# EAGLE schematic cpu (EAGLE 9.2.2)

## Sheet 1 of 8
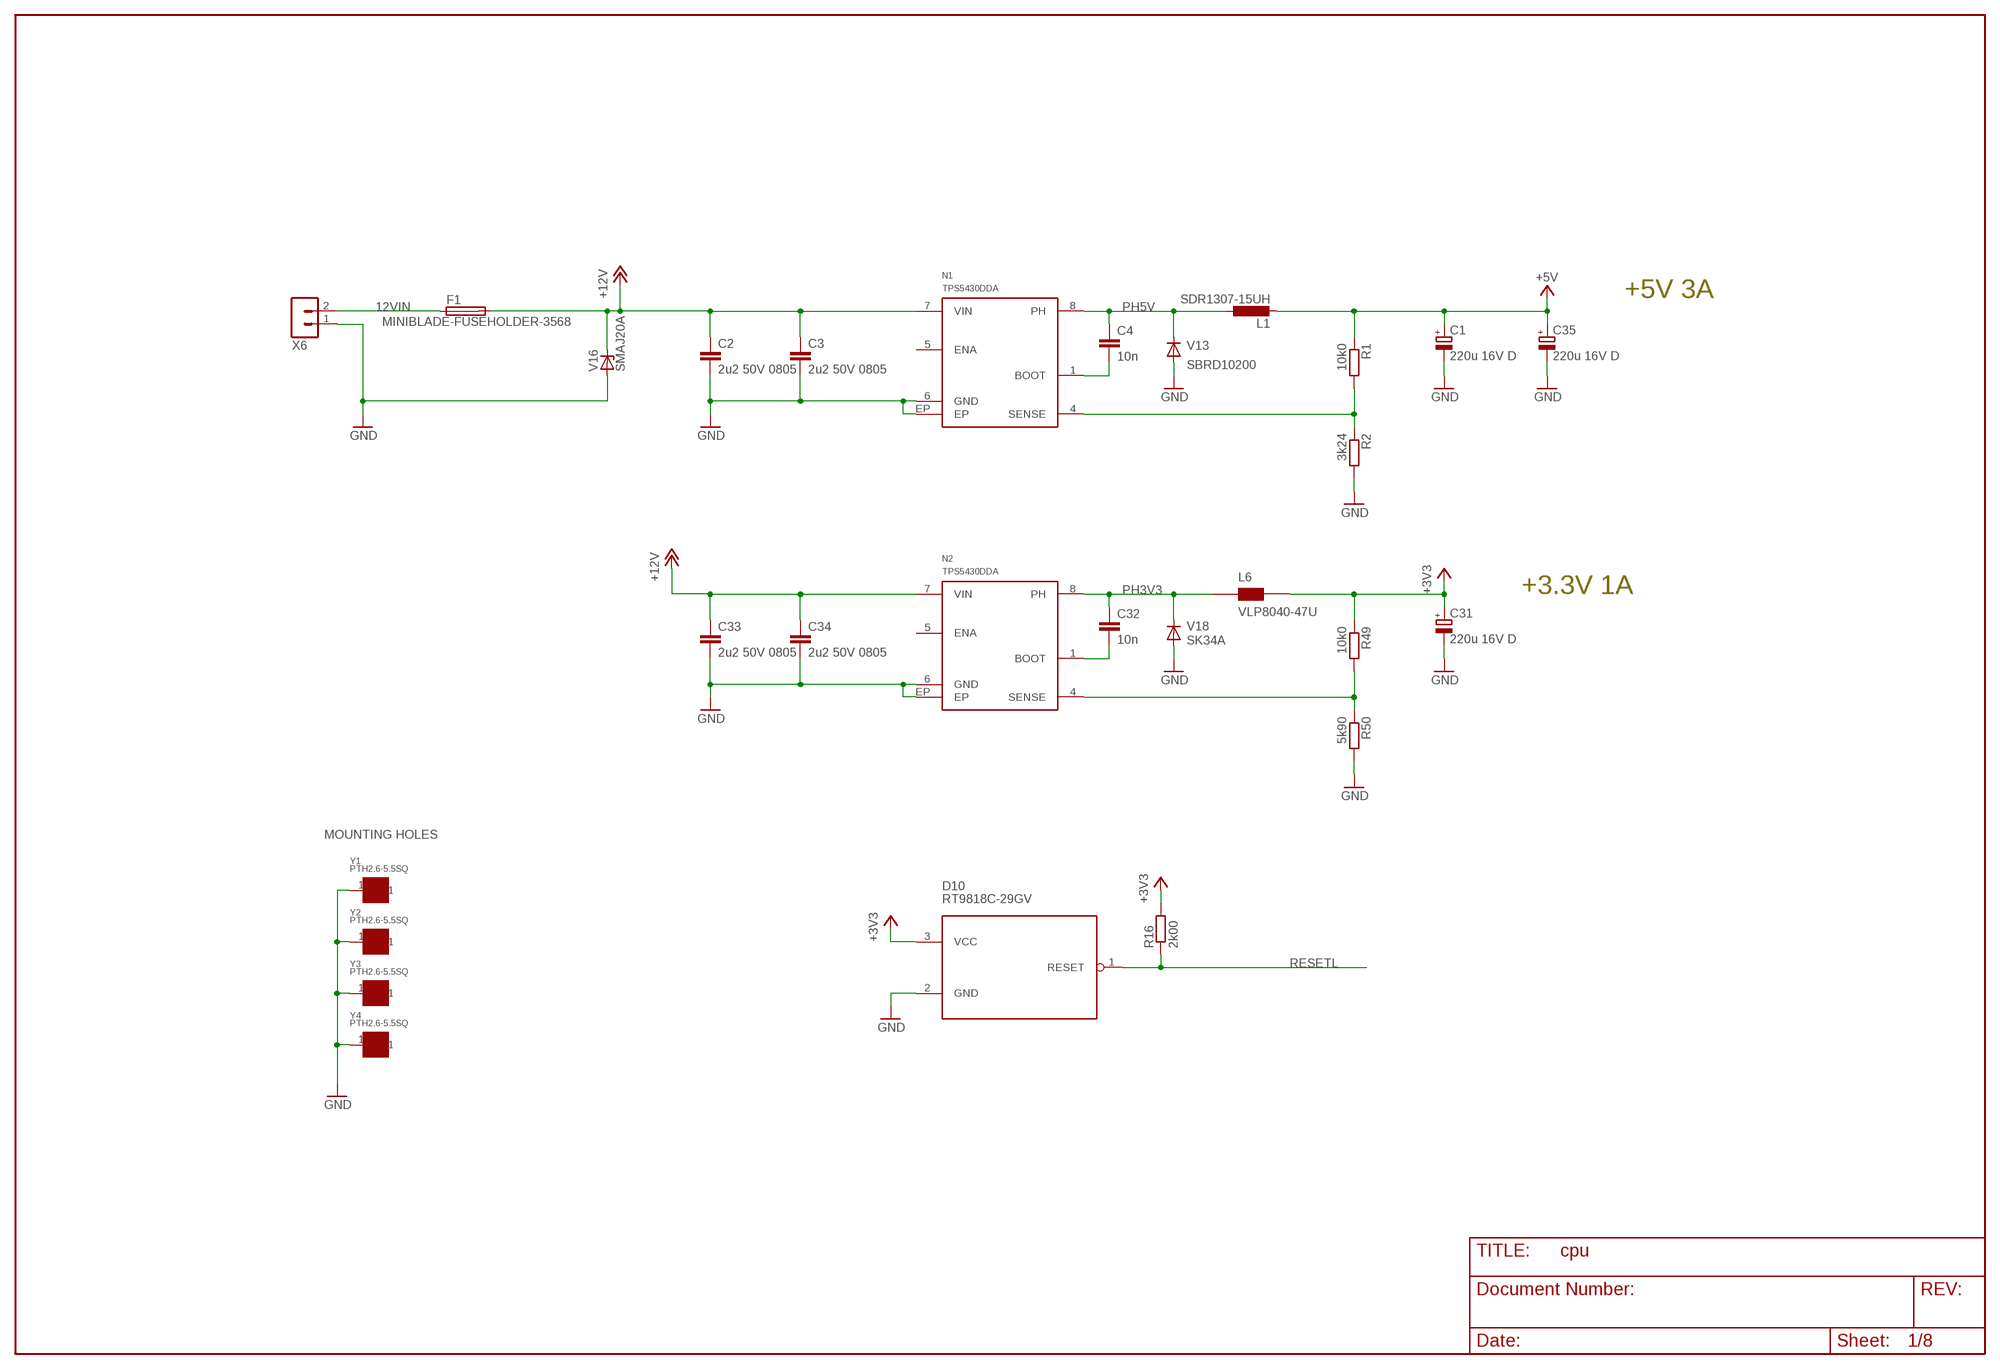
[diagram p0: schematic, sheet 1]

### Parts
C1  220u 16V D  CPOL-EUCT7343  [CT7343]
C2  2u2 50V 0805  CAP0805  [C0805]
C3  2u2 50V 0805  CAP0805  [C0805]
C4  10n  CAP0603  [C0603]
C31  220u 16V D  CPOL-EUCT7343  [CT7343]
C32  10n  CAP0603  [C0603]
C33  2u2 50V 0805  CAP0805  [C0805]
C34  2u2 50V 0805  CAP0805  [C0805]
C35  220u 16V D  CPOL-EUCT7343  [CT7343]
D10  RT9818C-29GV  [SOT23]
F1  MINIBLADE-FUSEHOLDER-3568  [KEYSTONE-3568]
L1  SDR1307-15UH  INDSDR1307  [SDR1307]
L6  VLP8040-47U  [VLP8040]
N1  TPS5430DDA  [SOIC8-N-EP]
N2  TPS5430DDA  [SOIC8-N-EP]
R1  10k0  RES0603  [R0603]
R2  3k24  RES0603  [R0603]
R16  2k00  RES0603  [R0603]
R49  10k0  RES0603  [R0603]
R50  5k90  RES0603  [R0603]
V13  SBRD10200  [DPACK]
V16  SMAJ20A  SMAJXXA  [DO214AC]
V18  SK34A  [DO214AC]
X6  TE_RUUVILIITIN2  [TE_RUUVILIITIN2]
Y1  PTH2.6-5.5SQ  [PTH-2.6-5.5SQ]
Y2  PTH2.6-5.5SQ  [PTH-2.6-5.5SQ]
Y3  PTH2.6-5.5SQ  [PTH-2.6-5.5SQ]
Y4  PTH2.6-5.5SQ  [PTH-2.6-5.5SQ]

### Nets
12VIN: F1.1 F1.4 X6.2
+3V3: C31.+ D10.3(VCC) L6.2(B) R16.2 R49.1 ; also sheet 2,3,4,7,8
+5V: C1.+ C35.+ L1.2 R1.1 ; also sheet 4,6,7
+12V: C2.1 C3.1 C33.1 C34.1 F1.2 F1.3 N1.7(VIN) N2.7(VIN) V16.C ; also sheet 2,5,8
BOOT3V3: C32.2 N2.1(BOOT)
BOOT5V: C4.2 N1.1(BOOT)
GND [other]: C1.- C2.2 C3.2 C31.- C33.2 C34.2 C35.- D10.2(GND) N1.6(GND) N1.EP N2.6(GND) N2.EP R2.2 R50.2 V13.1(A) V13.3(A) V16.A V18.A X6.1 Y1.1 Y2.1 Y3.1 Y4.1 ; also sheet 2,3,4,5,6,7,8
N$4: N1.4(SENSE) R1.2 R2.1
N$20: N2.4(SENSE) R49.2 R50.1
PH3V3: C32.1 L6.1(A) N2.8(PH) V18.C
PH5V: C4.1 L1.1 N1.8(PH) V13.2(C)
RESETL: D10.1(RESET) R16.1 ; also sheet 2
Unconnected: N1.5(ENA) N2.5(ENA)

### Notes on the sheet
- +5V 3A
- +3.3V 1A
- MOUNTING HOLES

## Sheet 2 of 8
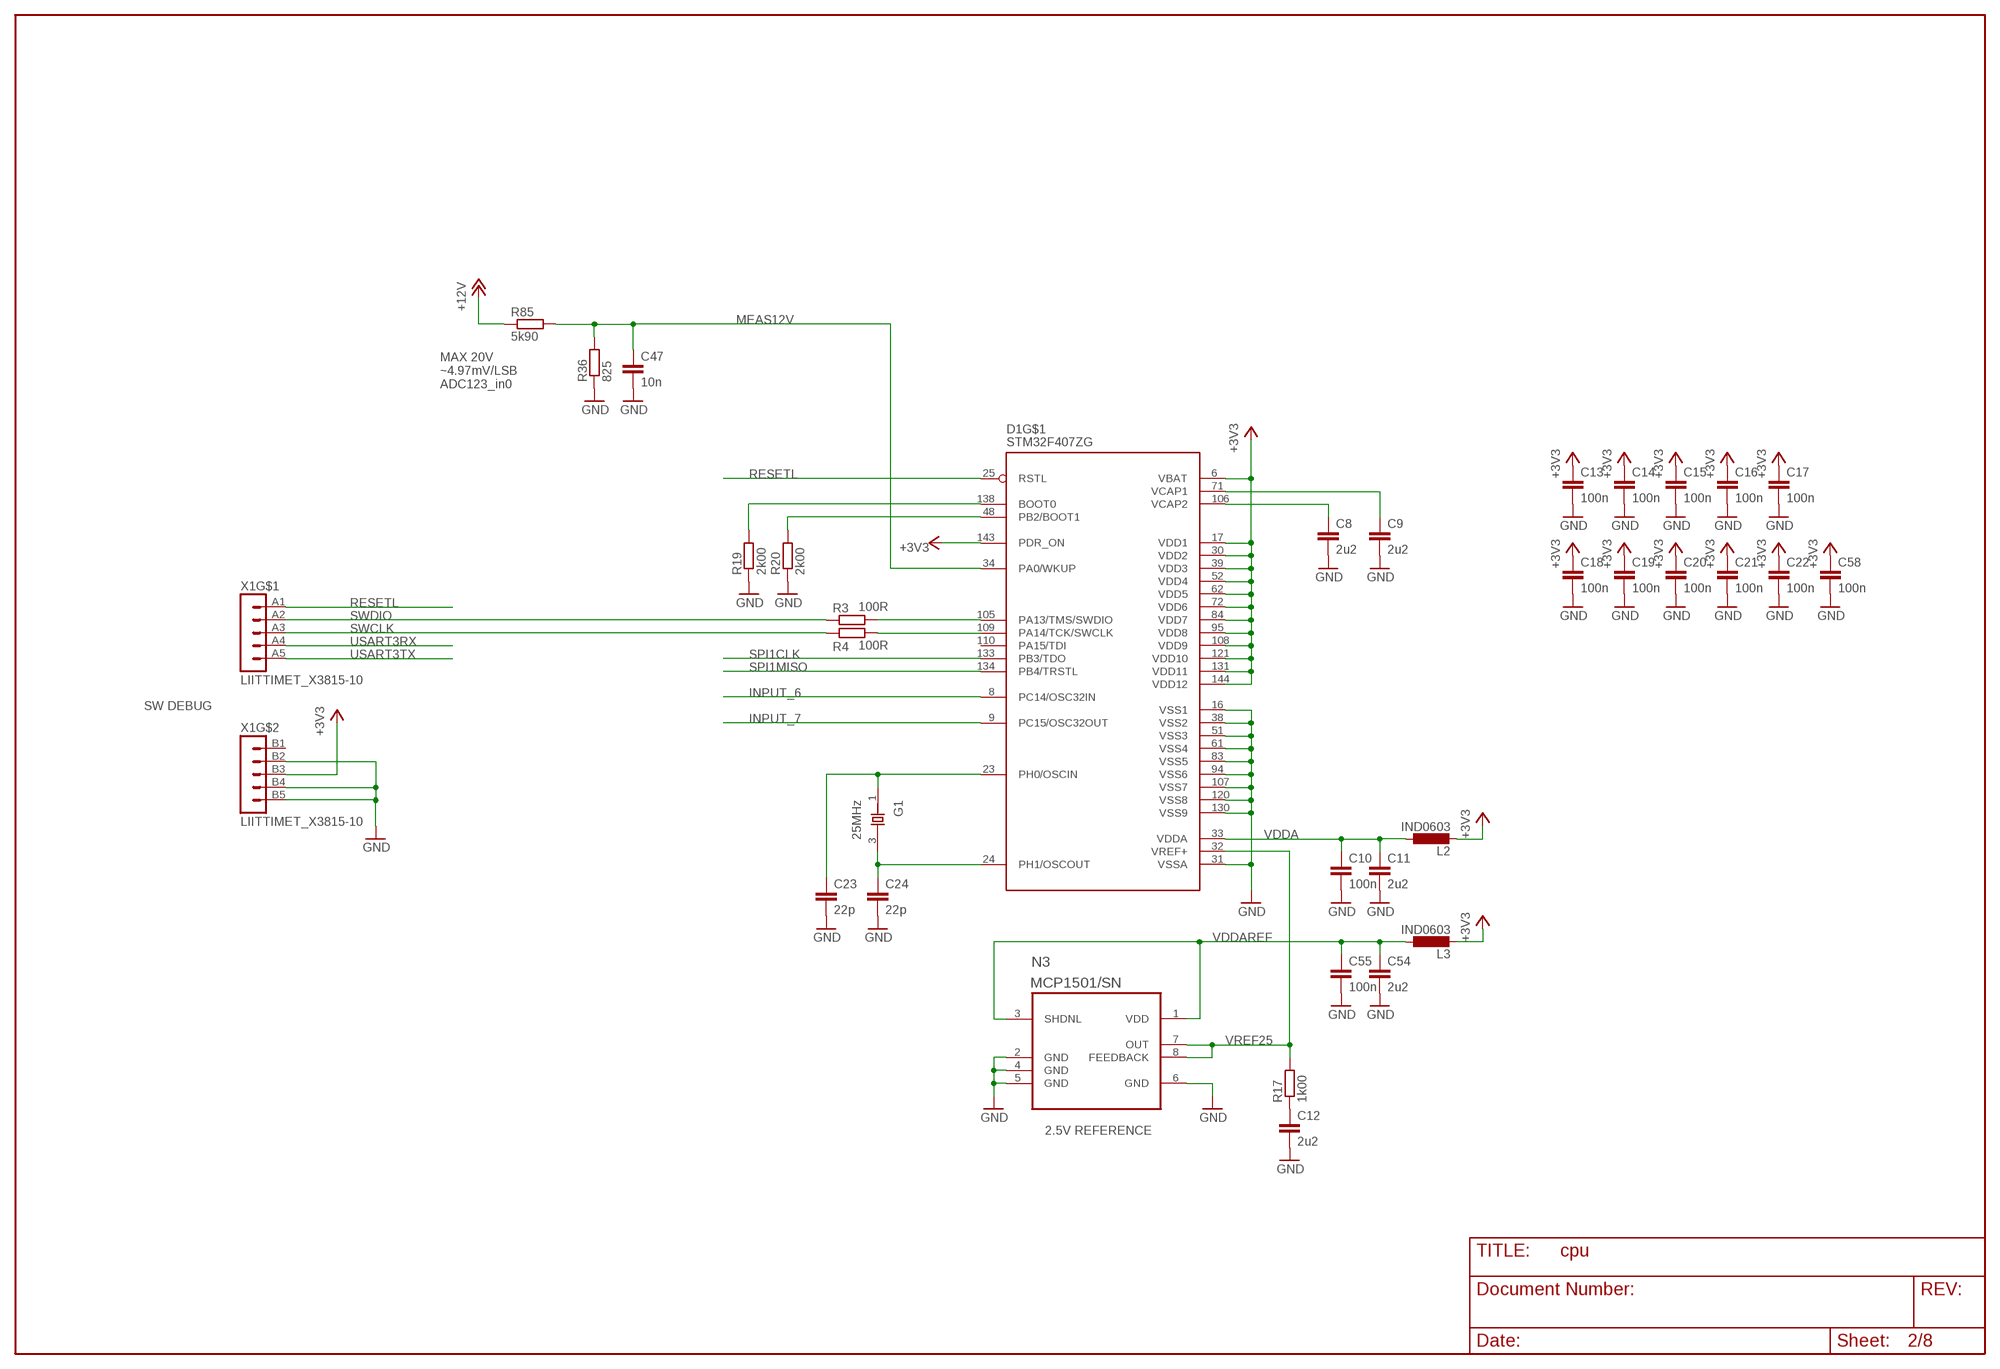
[diagram p1: schematic, sheet 2]

### Parts
C8  2u2  CAP0603  [C0603]
C9  2u2  CAP0603  [C0603]
C10  100n  CAP0603  [C0603]
C11  2u2  CAP0603  [C0603]
C12  2u2  CAP0603  [C0603]
C13  100n  CAP0603  [C0603]
C14  100n  CAP0603  [C0603]
C15  100n  CAP0603  [C0603]
C16  100n  CAP0603  [C0603]
C17  100n  CAP0603  [C0603]
C18  100n  CAP0603  [C0603]
C19  100n  CAP0603  [C0603]
C20  100n  CAP0603  [C0603]
C21  100n  CAP0603  [C0603]
C22  100n  CAP0603  [C0603]
C23  22p  CAP0603  [C0603]
C24  22p  CAP0603  [C0603]
C47  10n  CAP0603  [C0603]
C54  2u2  CAP0603  [C0603]
C55  100n  CAP0603  [C0603]
C58  100n  CAP0603  [C0603]
D1  STM32F407ZG  [LQFP-144]
G1  25MHz  XTAL_3225_SMD  [X_3225]
L2  IND0603  [R0603]
L3  IND0603  [R0603]
N3  MCP1501/SN  [SOIC8-N_MC]
R3  100R  PASSIIVIT_RES0603  [PASSIIVIT_R0603]
R4  100R  PASSIIVIT_RES0603  [PASSIIVIT_R0603]
R17  1k00  RES0603  [R0603]
R19  2k00  RES0603  [R0603]
R20  2k00  RES0603  [R0603]
R36  825  RES0603  [R0603]
R85  5k90  RES0603  [R0603]
X1  LIITTIMET_X3815-10  [LIITTIMET_15110102601]

### Nets
+3V3: C13.1 C14.1 C15.1 C16.1 C17.1 C18.1 C19.1 C20.1 C21.1 C22.1 C58.1 D1.6(VBAT) D1.17(VDD1) D1.30(VDD2) D1.39(VDD3) D1.52(VDD4) D1.62(VDD5) D1.72(VDD6) D1.84(VDD7) D1.95(VDD8) D1.108(VDD9) D1.121(VDD10) D1.131(VDD11) D1.143(PDR_ON) D1.144(VDD12) L2.2 L3.2 X1.B3 ; also sheet 1,3,4,7,8
+12V: R85.1 ; also sheet 1,5,8
BOOT0: D1.138(BOOT0) R19.2
GND [other]: C8.2 C9.2 C10.2 C11.2 C12.2 C13.2 C14.2 C15.2 C16.2 C17.2 C18.2 C19.2 C20.2 C21.2 C22.2 C23.2 C24.2 C47.2 C54.2 C55.2 C58.2 D1.16(VSS1) D1.31(VSSA) D1.38(VSS2) D1.51(VSS3) D1.61(VSS4) D1.83(VSS5) D1.94(VSS6) D1.107(VSS7) D1.120(VSS8) D1.130(VSS9) N3.2(GND) N3.4(GND) N3.5(GND) N3.6(GND) R19.1 R20.1 R36.1 X1.B2 X1.B4 X1.B5 ; also sheet 1,3,4,5,6,7,8
INPUT_6: D1.8(PC14/OSC32IN) ; also sheet 8
INPUT_7: D1.9(PC15/OSC32OUT) ; also sheet 8
MEAS12V: C47.1 D1.34(PA0/WKUP) R36.2 R85.2
N$16: D1.109(PA14/TCK/SWCLK) R4.2
N$22: D1.105(PA13/TMS/SWDIO) R3.2
N$24: C12.1 R17.1
N$29: D1.48(PB2/BOOT1) R20.2
OSCIN: C23.1 D1.23(PH0/OSCIN) G1.1(X1)
OSCOUT: C24.1 D1.24(PH1/OSCOUT) G1.3(X2)
RESETL: D1.25(RSTL) X1.A1 ; also sheet 1
SPI1CLK: D1.133(PB3/TDO) ; also sheet 3
SPI1MISO: D1.134(PB4/TRSTL) ; also sheet 3
SWCLK: R4.1 X1.A3
SWDIO: R3.1 X1.A2
USART3RX: X1.A4 ; also sheet 3
USART3TX: X1.A5 ; also sheet 3
VCAP1: C9.1 D1.71(VCAP1)
VCAP2: C8.1 D1.106(VCAP2)
VDDA: C10.1 C11.1 D1.33(VDDA) L2.1
VDDAREF: C54.1 C55.1 L3.1 N3.1(VDD) N3.3(SHDNL)
VREF25: D1.32(VREF+) N3.7(OUT) N3.8(FEEDBACK) R17.2
Unconnected: D1.110(PA15/TDI) X1.B1

### Notes on the sheet
- MAX 20V
  ~4.97mV/LSB
  ADC123_in0
- SW DEBUG
- 2.5V REFERENCE

## Sheet 3 of 8
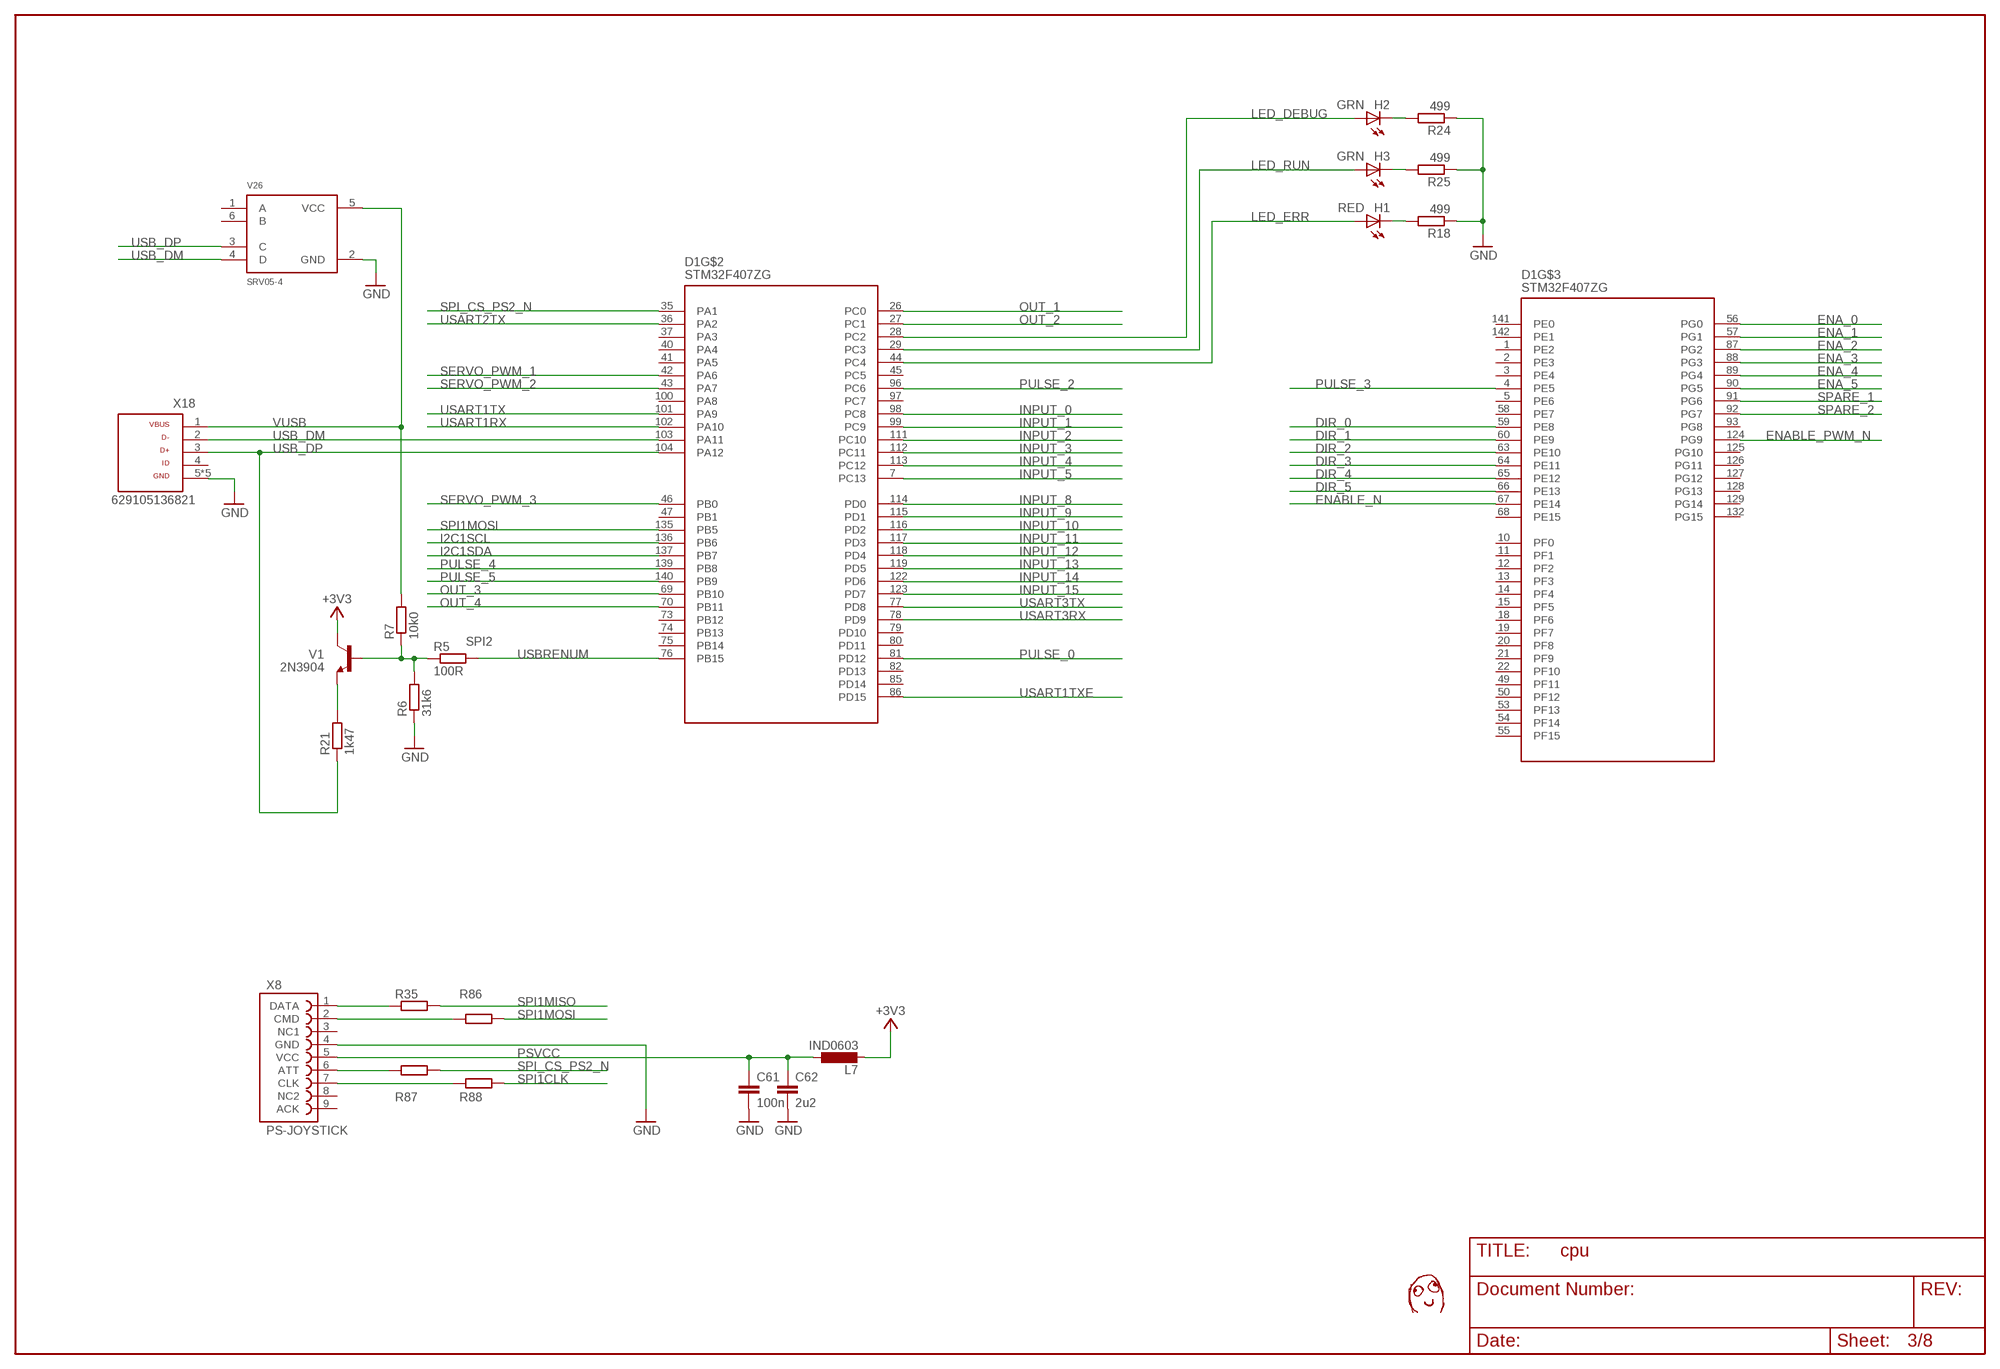
[diagram p2: schematic, sheet 3]

### Parts
C61  100n  CAP0603  [C0603]
C62  2u2  CAP0603  [C0603]
H1  RED  LEDCHIP-LED0603  [CHIP-LED0603]
H2  GRN  LEDCHIP-LED0603  [CHIP-LED0603]
H3  GRN  LEDCHIP-LED0603  [CHIP-LED0603]
L7  IND0603  [R0603]
R5  100R  PASSIIVIT_RES0603  [PASSIIVIT_R0603]
R6  31k6  PASSIIVIT_RES0603  [PASSIIVIT_R0603]
R7  10k0  PASSIIVIT_RES0603  [PASSIIVIT_R0603]
R18  499  RES0603  [R0603]
R21  1k47  PASSIIVIT_RES0603  [PASSIIVIT_R0603]
R24  499  RES0603  [R0603]
R25  499  RES0603  [R0603]
R35  RES0603  [OMAT_IC_2_R0603]
R86  RES0603  [OMAT_IC_2_R0603]
R87  RES0603  [OMAT_IC_2_R0603]
R88  RES0603  [OMAT_IC_2_R0603]
U$1  DAFUG  [DAFUG]
V1  2N3904  [OMAT_IC_2_SOT23]
V26  SRV05-4  [OMAT_IC_2_SOT23-6]
X8  PS-JOYSTICK  [PS-JOYSTICK]
X18  629105136821  [629105136821]

### Nets
+3V3: L7.2 V1.3(C) ; also sheet 1,2,4,7,8
DIR_0: D1.59(PE8) ; also sheet 7
DIR_1: D1.60(PE9) ; also sheet 7
DIR_2: D1.63(PE10) ; also sheet 7
DIR_3: D1.64(PE11) ; also sheet 7
DIR_4: D1.65(PE12) ; also sheet 7
DIR_5: D1.66(PE13) ; also sheet 7
ENA_0: D1.56(PG0) ; also sheet 7
ENA_1: D1.57(PG1) ; also sheet 7
ENA_2: D1.87(PG2) ; also sheet 7
ENA_3: D1.88(PG3) ; also sheet 7
ENA_4: D1.89(PG4) ; also sheet 7
ENA_5: D1.90(PG5) ; also sheet 7
ENABLE_N [other]: D1.67(PE14) ; also sheet 7
ENABLE_PWM_N [other]: D1.124(PG9) ; also sheet 6
GND [other]: C61.2 C62.2 R6.1 R18.1 R24.1 R25.1 V26.2(GND) X8.4(GND) X18.5 X18.Z1 X18.Z2 X18.Z3 X18.Z4 ; also sheet 1,2,4,5,6,7,8
I2C1SCL: D1.136(PB6) ; also sheet 4
I2C1SDA: D1.137(PB7) ; also sheet 4
INPUT_0: D1.98(PC8) ; also sheet 8
INPUT_1: D1.99(PC9) ; also sheet 8
INPUT_2: D1.111(PC10) ; also sheet 8
INPUT_3: D1.112(PC11) ; also sheet 8
INPUT_4: D1.113(PC12) ; also sheet 8
INPUT_5: D1.7(PC13) ; also sheet 8
INPUT_8: D1.114(PD0) ; also sheet 8
INPUT_9: D1.115(PD1) ; also sheet 8
INPUT_10: D1.116(PD2) ; also sheet 8
INPUT_11: D1.117(PD3) ; also sheet 8
INPUT_12: D1.118(PD4) ; also sheet 8
INPUT_13: D1.119(PD5) ; also sheet 8
INPUT_14: D1.122(PD6) ; also sheet 8
INPUT_15: D1.123(PD7) ; also sheet 8
LED_DEBUG: D1.28(PC2) H2.A
LED_ERR: D1.44(PC4) H1.A
LED_RUN: D1.29(PC3) H3.A
N$3: R35.1 X8.1(DATA)
N$5: R5.1 R6.2 R7.1 V1.1(B)
N$6: R21.2 V1.2(E)
N$21: R86.1 X8.2(CMD)
N$23: H2.C R24.2
N$25: H1.C R18.2
N$28: H3.C R25.2
N$39: R87.1 X8.6(ATT)
N$42: R88.1 X8.7(CLK)
OUT_1: D1.26(PC0) ; also sheet 5
OUT_2: D1.27(PC1) ; also sheet 5
OUT_3: D1.69(PB10) ; also sheet 5
OUT_4: D1.70(PB11) ; also sheet 5
PSVCC: C61.1 C62.1 L7.1 X8.5(VCC)
PULSE_0: D1.81(PD12) ; also sheet 7
PULSE_2: D1.96(PC6) ; also sheet 7
PULSE_3: D1.4(PE5) ; also sheet 7
PULSE_4: D1.139(PB8) ; also sheet 7
PULSE_5: D1.140(PB9) ; also sheet 7
SERVO_PWM_1: D1.42(PA6) ; also sheet 6
SERVO_PWM_2: D1.43(PA7) ; also sheet 6
SERVO_PWM_3: D1.46(PB0) ; also sheet 6
SPARE_1: D1.91(PG6) ; also sheet 7
SPARE_2: D1.92(PG7) ; also sheet 7
SPI1CLK: R88.2 ; also sheet 2
SPI1MISO: R35.2 ; also sheet 2
SPI1MOSI: D1.135(PB5) R86.2
SPI_CS_PS2_N: D1.35(PA1) R87.2
USART1RX: D1.102(PA10) ; also sheet 4
USART1TX: D1.101(PA9) ; also sheet 4
USART1TXE: D1.86(PD15) ; also sheet 4
USART2TX: D1.36(PA2) ; also sheet 6
USART3RX: D1.78(PD9) ; also sheet 2
USART3TX: D1.77(PD8) ; also sheet 2
USB_DM: D1.103(PA11) V26.4(D) X18.2
USB_DP: D1.104(PA12) R21.1 V26.3(C) X18.3
USBRENUM: D1.76(PB15) R5.2
VUSB: R7.2 V26.5(VCC) X18.1
Unconnected: D1.1(PE2) D1.2(PE3) D1.3(PE4) D1.5(PE6) D1.10(PF0) D1.11(PF1) D1.12(PF2) D1.13(PF3) D1.14(PF4) D1.15(PF5) D1.18(PF6) D1.19(PF7) D1.20(PF8) D1.21(PF9) D1.22(PF10) D1.37(PA3) D1.40(PA4) D1.41(PA5) D1.45(PC5) D1.47(PB1) D1.49(PF11) D1.50(PF12) D1.53(PF13) D1.54(PF14) D1.55(PF15) D1.58(PE7) D1.68(PE15) D1.73(PB12) D1.74(PB13) D1.75(PB14) D1.79(PD10) D1.80(PD11) D1.82(PD13) D1.85(PD14) D1.93(PG8) D1.97(PC7) D1.100(PA8) D1.125(PG10) D1.126(PG11) D1.127(PG12) D1.128(PG13) D1.129(PG14) D1.132(PG15) D1.141(PE0) D1.142(PE1) V26.1(A) V26.6(B) X8.3(NC1) X8.8(NC2) X8.9(ACK) X18.4

### Notes on the sheet
- SPI2

## Sheet 4 of 8
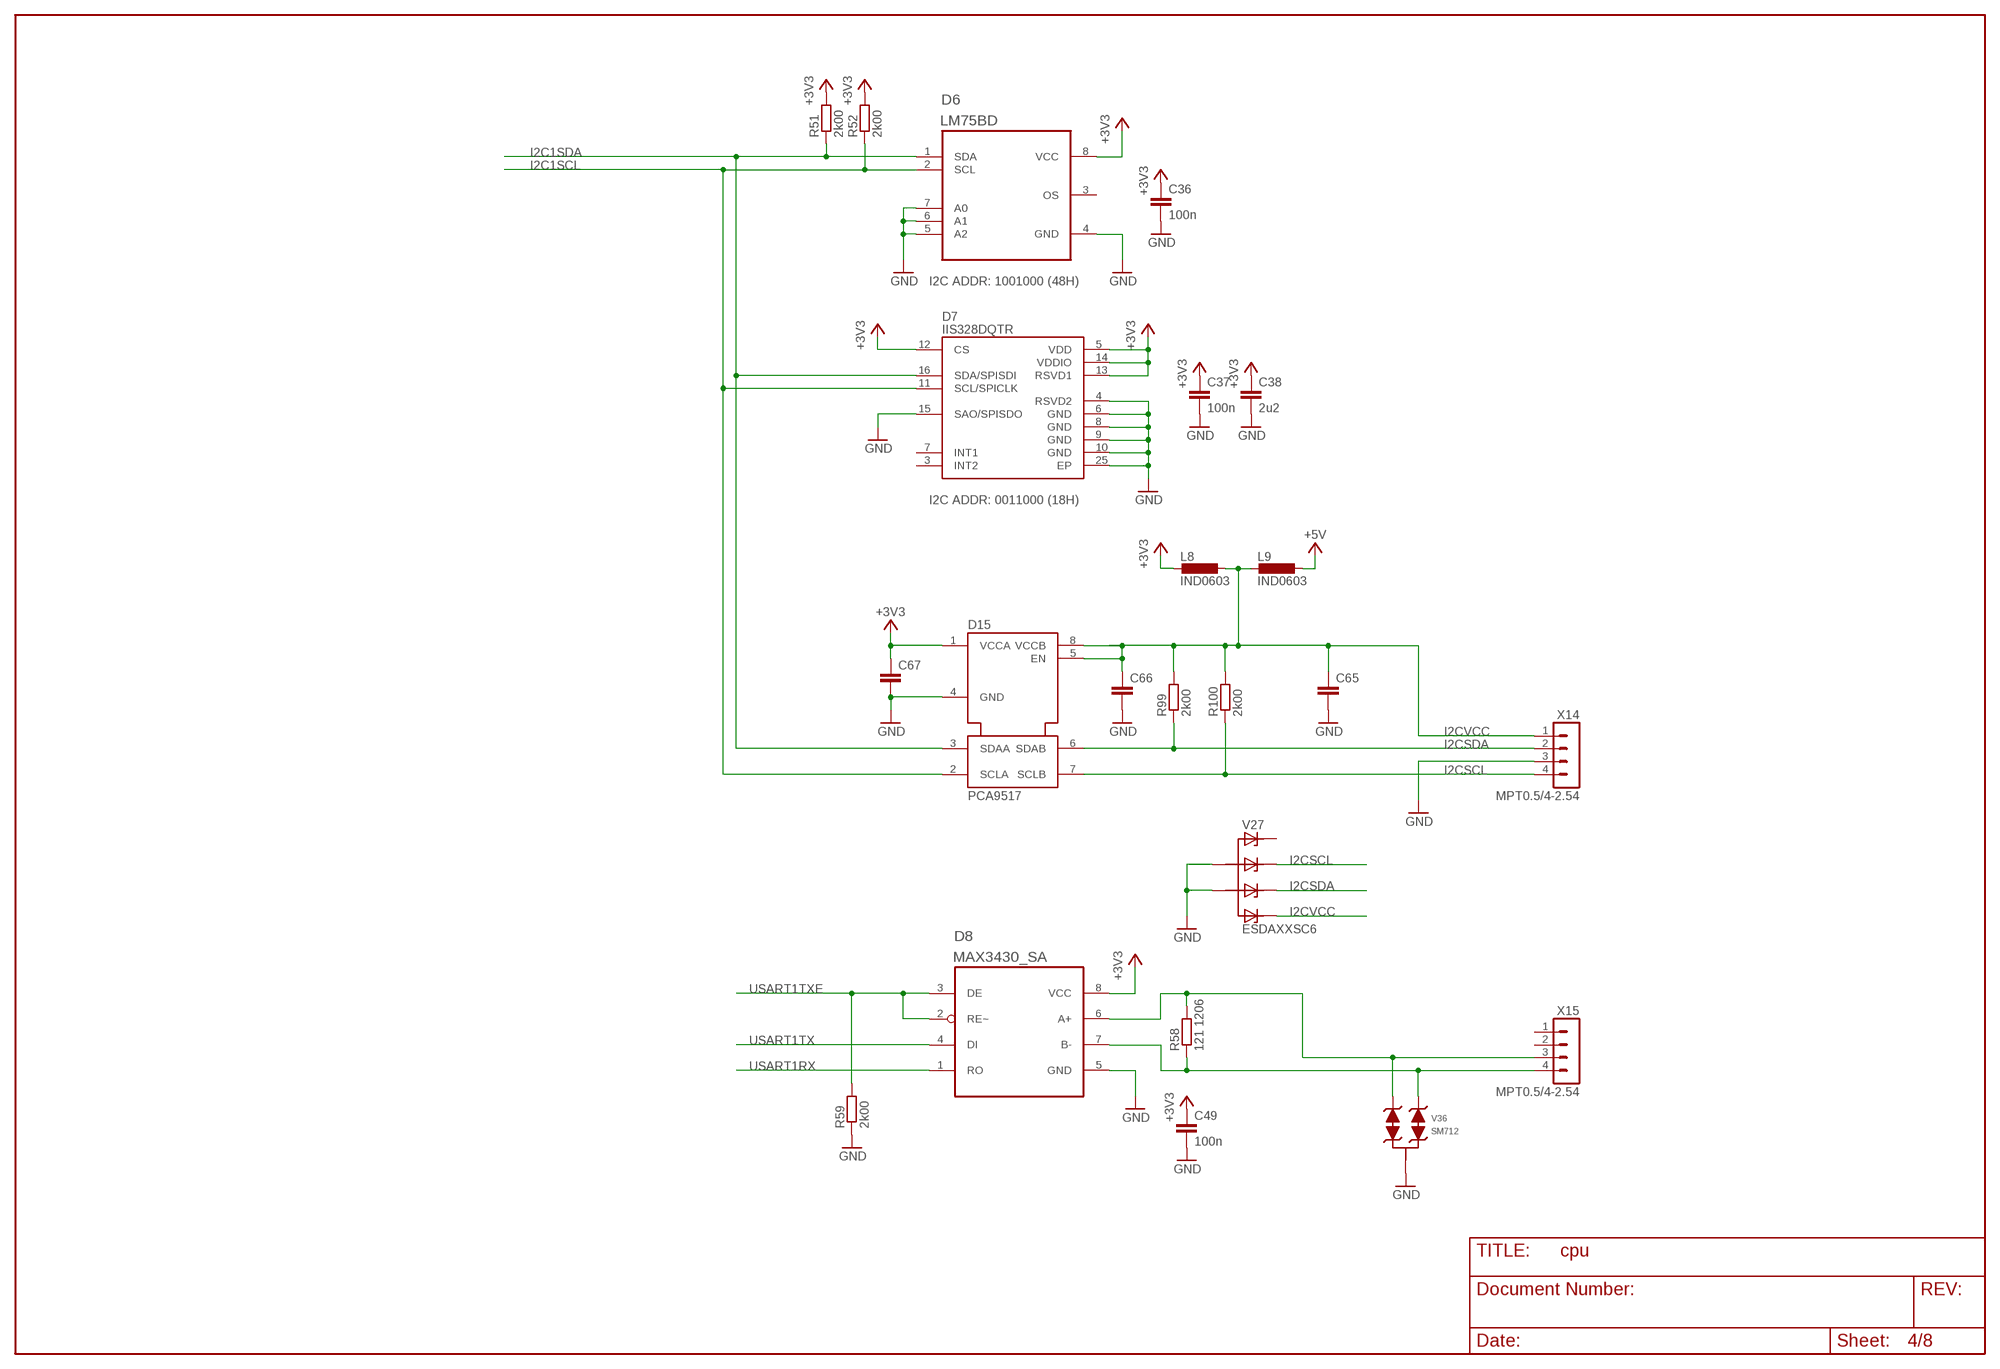
[diagram p3: schematic, sheet 4]

### Parts
C36  100n  CAP0603  [C0603]
C37  100n  CAP0603  [C0603]
C38  2u2  CAP0603  [C0603]
C49  100n  CAP0603  [C0603]
C65  CAP0805  [OMAT_IC_2_C0805]
C66  CAP0805  [OMAT_IC_2_C0805]
C67  CAP0805  [OMAT_IC_2_C0805]
D6  LM75BD  [SOIC8-N_MC]
D7  IIS328DQTR  [QFN50P400X400X100-25N]
D8  MAX3430_SA  MAX3088_SA  [SOIC8-N_MC]
D15  PCA9517  [OMAT_IC_2_SOIC8-N_MC]
L8  IND0603  [OMAT_IC_2_R0603]
L9  IND0603  [OMAT_IC_2_R0603]
R51  2k00  RES0603  [R0603]
R52  2k00  RES0603  [R0603]
R58  121 1206  RES1206  [R1206]
R59  2k00  RES0603  [R0603]
R99  2k00  RES0603  [R0603]
R100  2k00  RES0603  [R0603]
V27  ESDAXXSC6  [OMAT_IC_2_SOT23-6]
V36  SM712  [SOT23]
X14  MPT0.5/4-2.54  [MPT0.5/4-2.54]
X15  MPT0.5/4-2.54  [MPT0.5/4-2.54]

### Nets
+3V3: C36.1 C37.1 C38.1 C49.1 C67.1 D6.8(VCC) D7.5(VDD) D7.12(CS) D7.13(RSVD1) D7.14(VDDIO) D8.8(VCC) D15.1(VCCA) L8.2 R51.2 R52.2 ; also sheet 1,2,3,7,8
+5V: L9.1 ; also sheet 1,6,7
ACCRTXHI: D8.6(A+) R58.2 V36.2 X15.3
ACCRTXLO: D8.7(B-) R58.1 V36.1 X15.4
GND [other]: C36.2 C37.2 C38.2 C49.2 C65.2 C66.2 C67.2 D6.4(GND) D6.5(A2) D6.6(A1) D6.7(A0) D7.4(RSVD2) D7.6(GND) D7.8(GND) D7.9(GND) D7.10(GND) D7.15(SAO/SPISDO) D7.25(EP) D8.5(GND) D15.4(GND) R59.1 V27.2(A) V27.5(A1) V36.3 X14.3 ; also sheet 1,2,3,5,6,7,8
I2C1SCL: D6.2(SCL) D7.11(SCL/SPICLK) D15.2(SCLA) R52.1 ; also sheet 3
I2C1SDA: D6.1(SDA) D7.16(SDA/SPISDI) D15.3(SDAA) R51.1 ; also sheet 3
I2CSCL: D15.7(SCLB) R100.1 V27.3(C1) X14.4
I2CSDA: D15.6(SDAB) R99.1 V27.4(C2) X14.2
I2CVCC: C65.1 C66.1 D15.5(EN) D15.8(VCCB) L8.1 L9.2 R99.2 R100.2 V27.6(C3) X14.1
USART1RX: D8.1(RO) ; also sheet 3
USART1TX: D8.4(DI) ; also sheet 3
USART1TXE: D8.2(RE~) D8.3(DE) R59.2 ; also sheet 3
Unconnected: D6.3(OS) D7.3(INT2) D7.7(INT1) V27.1(C) X15.1 X15.2

### Notes on the sheet
- I2C ADDR: 1001000 (48H)
- I2C ADDR: 0011000 (18H)

## Sheet 5 of 8
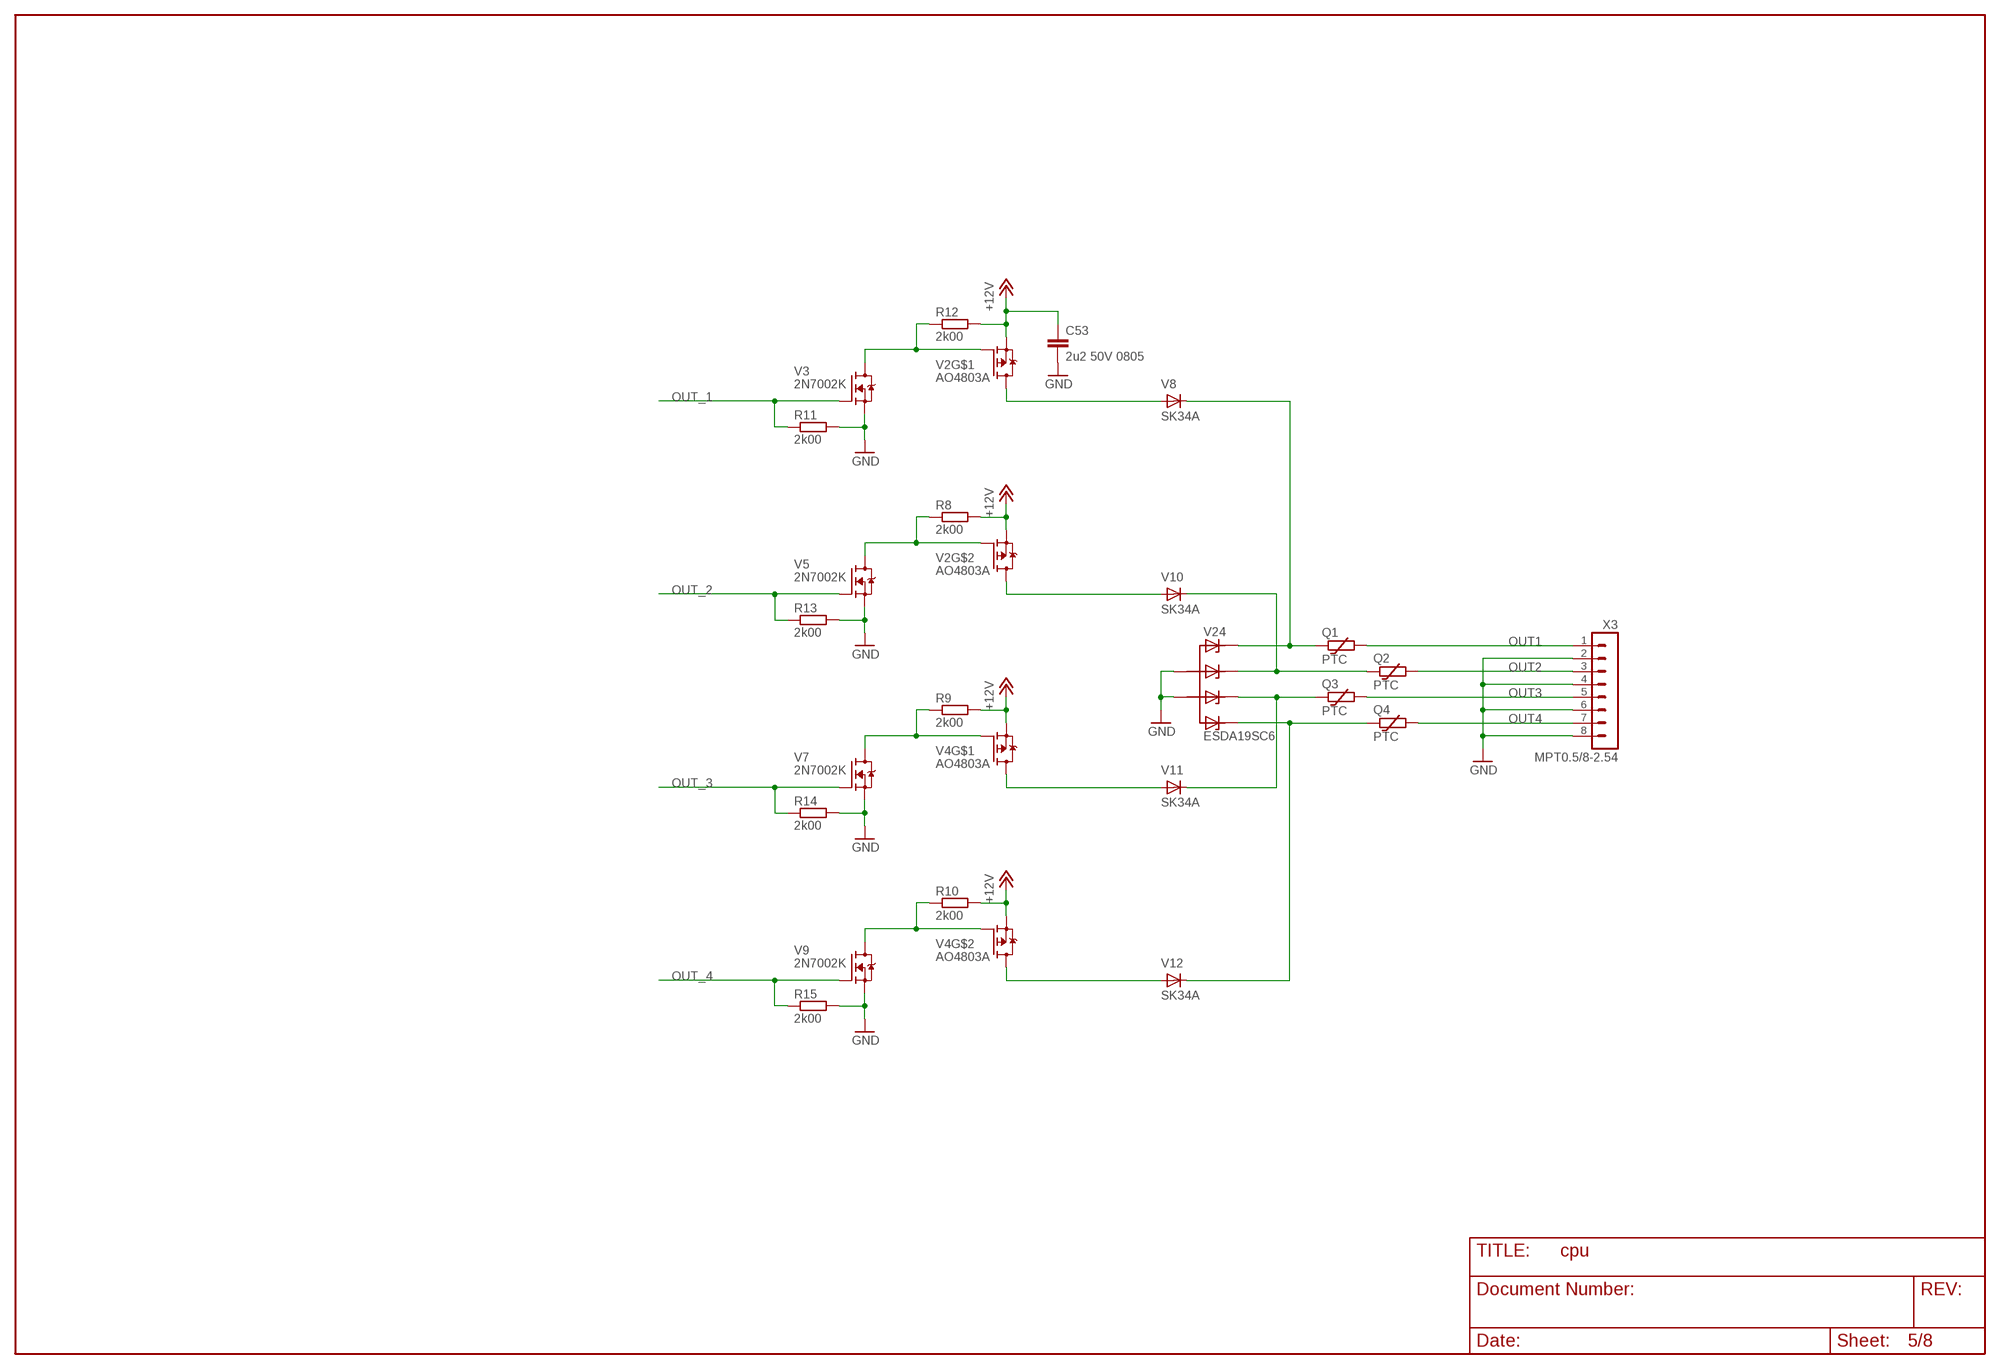
[diagram p4: schematic, sheet 5]

### Parts
C53  2u2 50V 0805  CAP0805  [C0805]
Q1  PTC  [OMAT_IC_2_R1812]
Q2  PTC  [OMAT_IC_2_R1812]
Q3  PTC  [OMAT_IC_2_R1812]
Q4  PTC  [OMAT_IC_2_R1812]
R8  2k00  RES0603  [R0603]
R9  2k00  RES0603  [R0603]
R10  2k00  RES0603  [R0603]
R11  2k00  RES0603  [R0603]
R12  2k00  RES0603  [R0603]
R13  2k00  RES0603  [R0603]
R14  2k00  RES0603  [R0603]
R15  2k00  RES0603  [R0603]
V2  AO4803A  [SOIC8-N_MC]
V3  2N7002K  [SOT23]
V4  AO4803A  [SOIC8-N_MC]
V5  2N7002K  [SOT23]
V7  2N7002K  [SOT23]
V8  SK34A  [DO214AC]
V9  2N7002K  [SOT23]
V10  SK34A  [DO214AC]
V11  SK34A  [DO214AC]
V12  SK34A  [DO214AC]
V24  ESDA19SC6  ESDAXXSC6  [SOT23-6]
X3  MPT0.5/8-2.54  [MPT0.5/8-2.54]

### Nets
+12V: C53.1 R8.2 R9.2 R10.2 R12.2 V2.1(S) V2.3(S) V4.1(S) V4.3(S) ; also sheet 1,2,8
GND [other]: C53.2 R11.2 R13.2 R14.2 R15.2 V3.2(S) V5.2(S) V7.2(S) V9.2(S) V24.2(A) V24.5(A1) X3.2 X3.4 X3.6 X3.8 ; also sheet 1,2,3,4,6,7,8
N$10: R8.1 V2.2(G) V5.3(D)
N$11: R12.1 V2.4(G) V3.3(D)
N$13: R9.1 V4.4(G) V7.3(D)
N$15: R10.1 V4.2(G) V9.3(D)
NERT: V2.5(D) V2.6(D) V8.A
NERT1: V2.7(D) V2.8(D) V10.A
NERT2: V4.5(D) V4.6(D) V11.A
NERT3: V4.7(D) V4.8(D) V12.A
OUT1: Q1.2 X3.1
OUT1X: Q1.1 V8.C V24.1(C)
OUT2: Q2.2 X3.3
OUT2X: Q2.1 V10.C V24.3(C1)
OUT3: Q3.2 X3.5
OUT3X: Q3.1 V11.C V24.4(C2)
OUT4: Q4.2 X3.7
OUT4X: Q4.1 V12.C V24.6(C3)
OUT_1: R11.1 V3.1(G) ; also sheet 3
OUT_2: R13.1 V5.1(G) ; also sheet 3
OUT_3: R14.1 V7.1(G) ; also sheet 3
OUT_4: R15.1 V9.1(G) ; also sheet 3

## Sheet 6 of 8
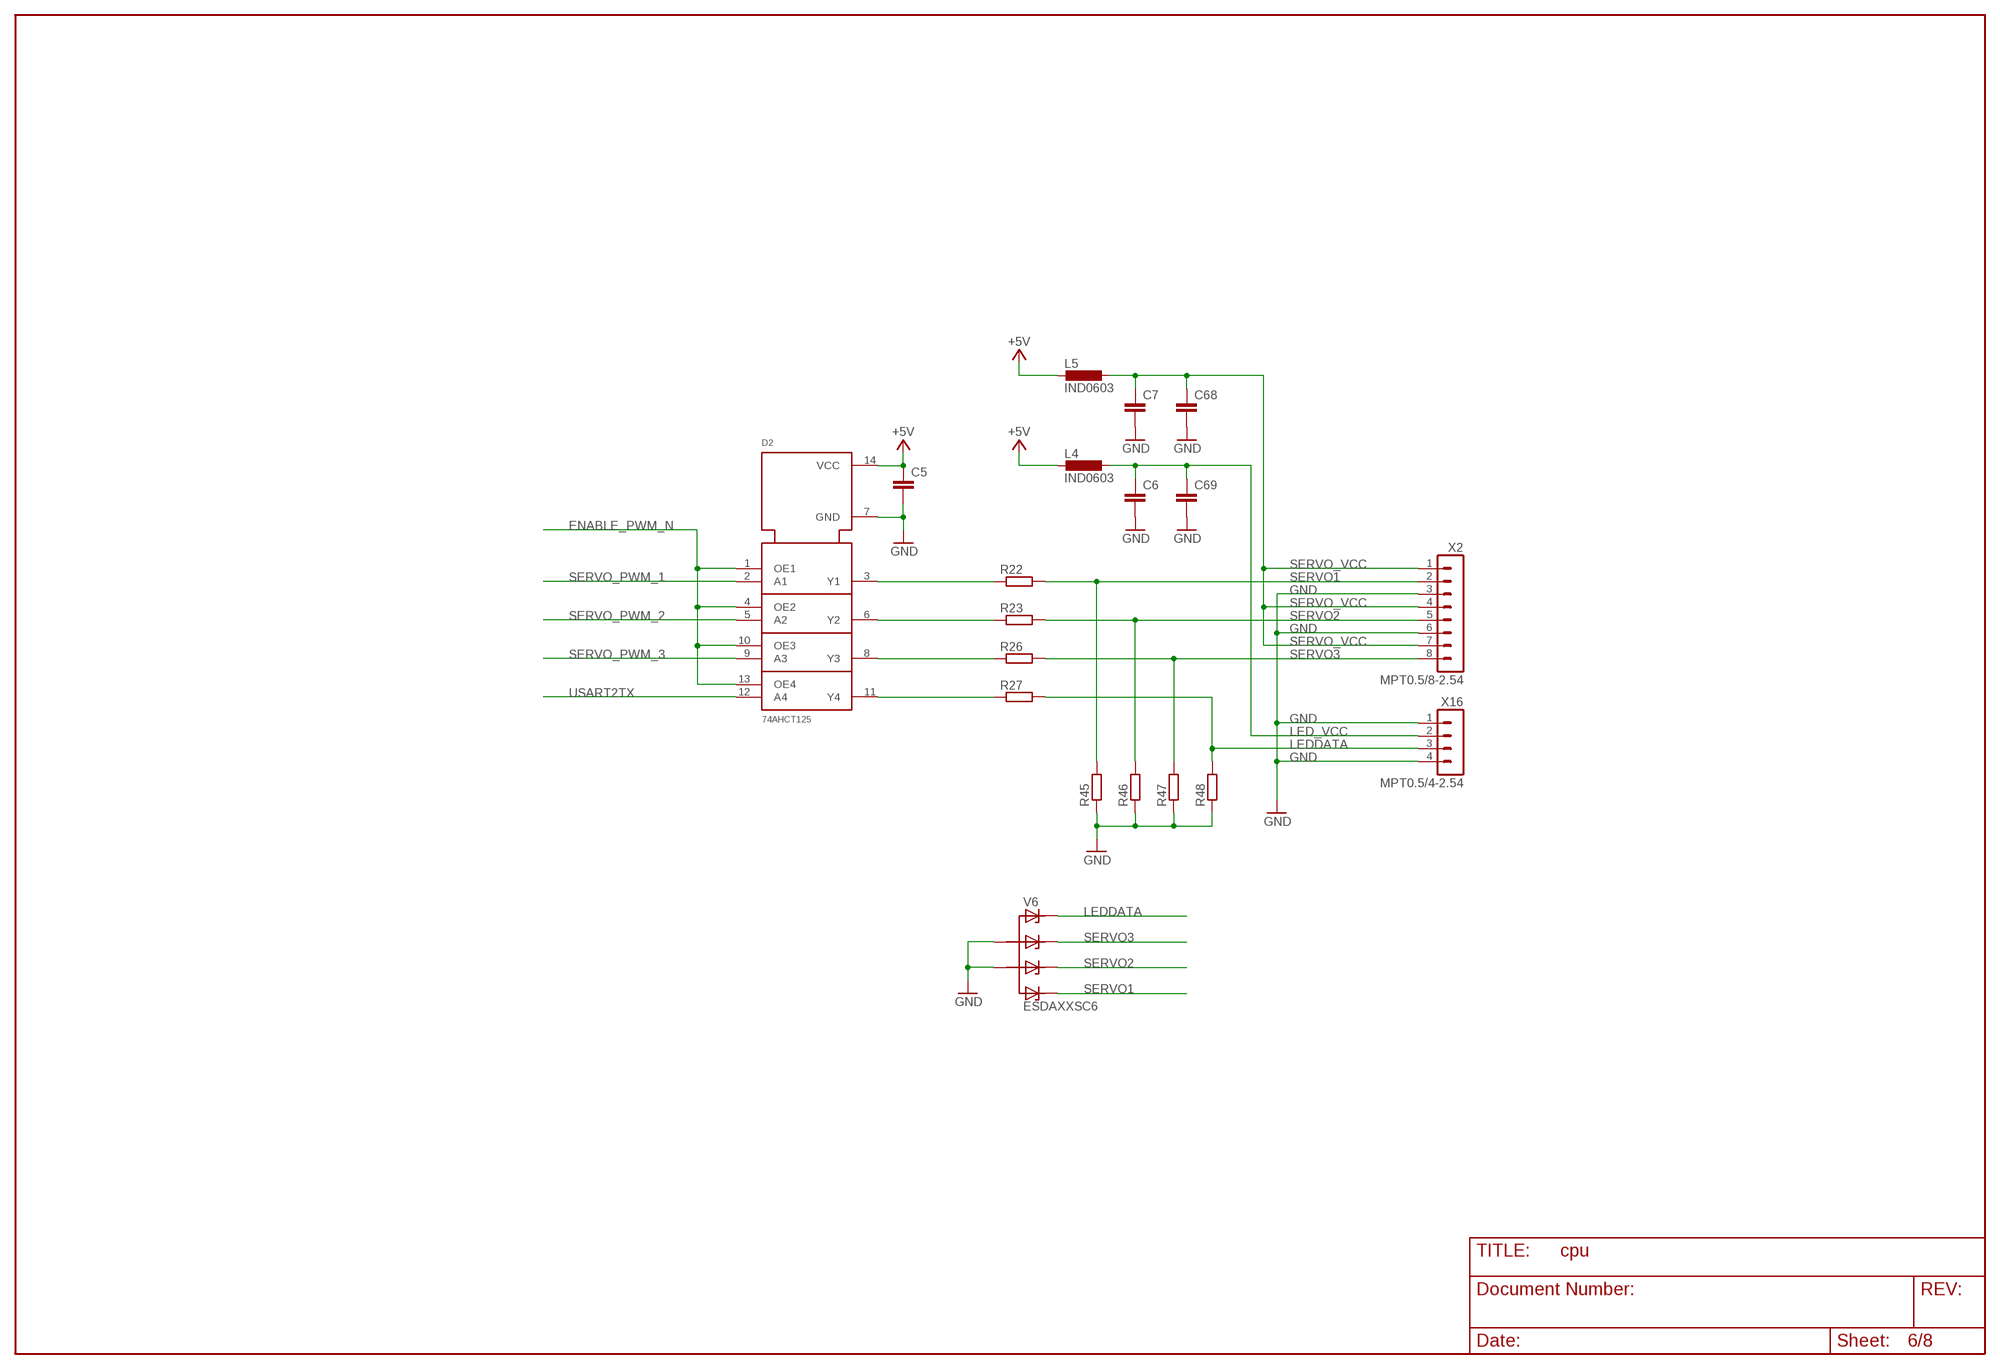
[diagram p5: schematic, sheet 6]

### Parts
C5  CAP0603  [OMAT_IC_2_C0603]
C6  CAP0805  [OMAT_IC_2_C0805]
C7  CAP0805  [OMAT_IC_2_C0805]
C68  CAP0805  [OMAT_IC_2_C0805]
C69  CAP0805  [OMAT_IC_2_C0805]
D2  74AHCT125  [SO14]
L4  IND0603  [OMAT_IC_2_R0603]
L5  IND0603  [OMAT_IC_2_R0603]
R22  RES0603  [OMAT_IC_2_R0603]
R23  RES0603  [OMAT_IC_2_R0603]
R26  RES0603  [OMAT_IC_2_R0603]
R27  RES0603  [OMAT_IC_2_R0603]
R45  RES0603  [OMAT_IC_2_R0603]
R46  RES0603  [OMAT_IC_2_R0603]
R47  RES0603  [OMAT_IC_2_R0603]
R48  RES0603  [OMAT_IC_2_R0603]
V6  ESDAXXSC6  [OMAT_IC_2_SOT23-6]
X2  MPT0.5/8-2.54  [OMAT_IC_2_MPT0.5/8-2.54]
X16  MPT0.5/4-2.54  [MPT0.5/4-2.54]

### Nets
+5V: C5.1 D2.14(VCC) L4.2 L5.2 ; also sheet 1,4,7
ENABLE_PWM_N [other]: D2.1(OE1) D2.4(OE2) D2.10(OE3) D2.13(OE4) ; also sheet 3
GND [other]: C5.2 C6.2 C7.2 C68.2 C69.2 D2.7(GND) R45.1 R46.1 R47.1 R48.1 V6.2(A) V6.5(A1) X2.3 X2.6 X16.1 X16.4 ; also sheet 1,2,3,4,5,7,8
LED_VCC: C6.1 C69.1 L4.1 X16.2
LEDDATA: R27.2 R48.2 V6.1(C) X16.3
N$18: D2.3(Y1) R22.1
N$26: D2.6(Y2) R23.1
N$27: D2.8(Y3) R26.1
N$40: D2.11(Y4) R27.1
SERVO1: R22.2 R45.2 V6.6(C3) X2.2
SERVO2: R23.2 R46.2 V6.4(C2) X2.5
SERVO3: R26.2 R47.2 V6.3(C1) X2.8
SERVO_PWM_1: D2.2(A1) ; also sheet 3
SERVO_PWM_2: D2.5(A2) ; also sheet 3
SERVO_PWM_3: D2.9(A3) ; also sheet 3
SERVO_VCC: C7.1 C68.1 L5.1 X2.1 X2.4 X2.7
USART2TX: D2.12(A4) ; also sheet 3

## Sheet 7 of 8
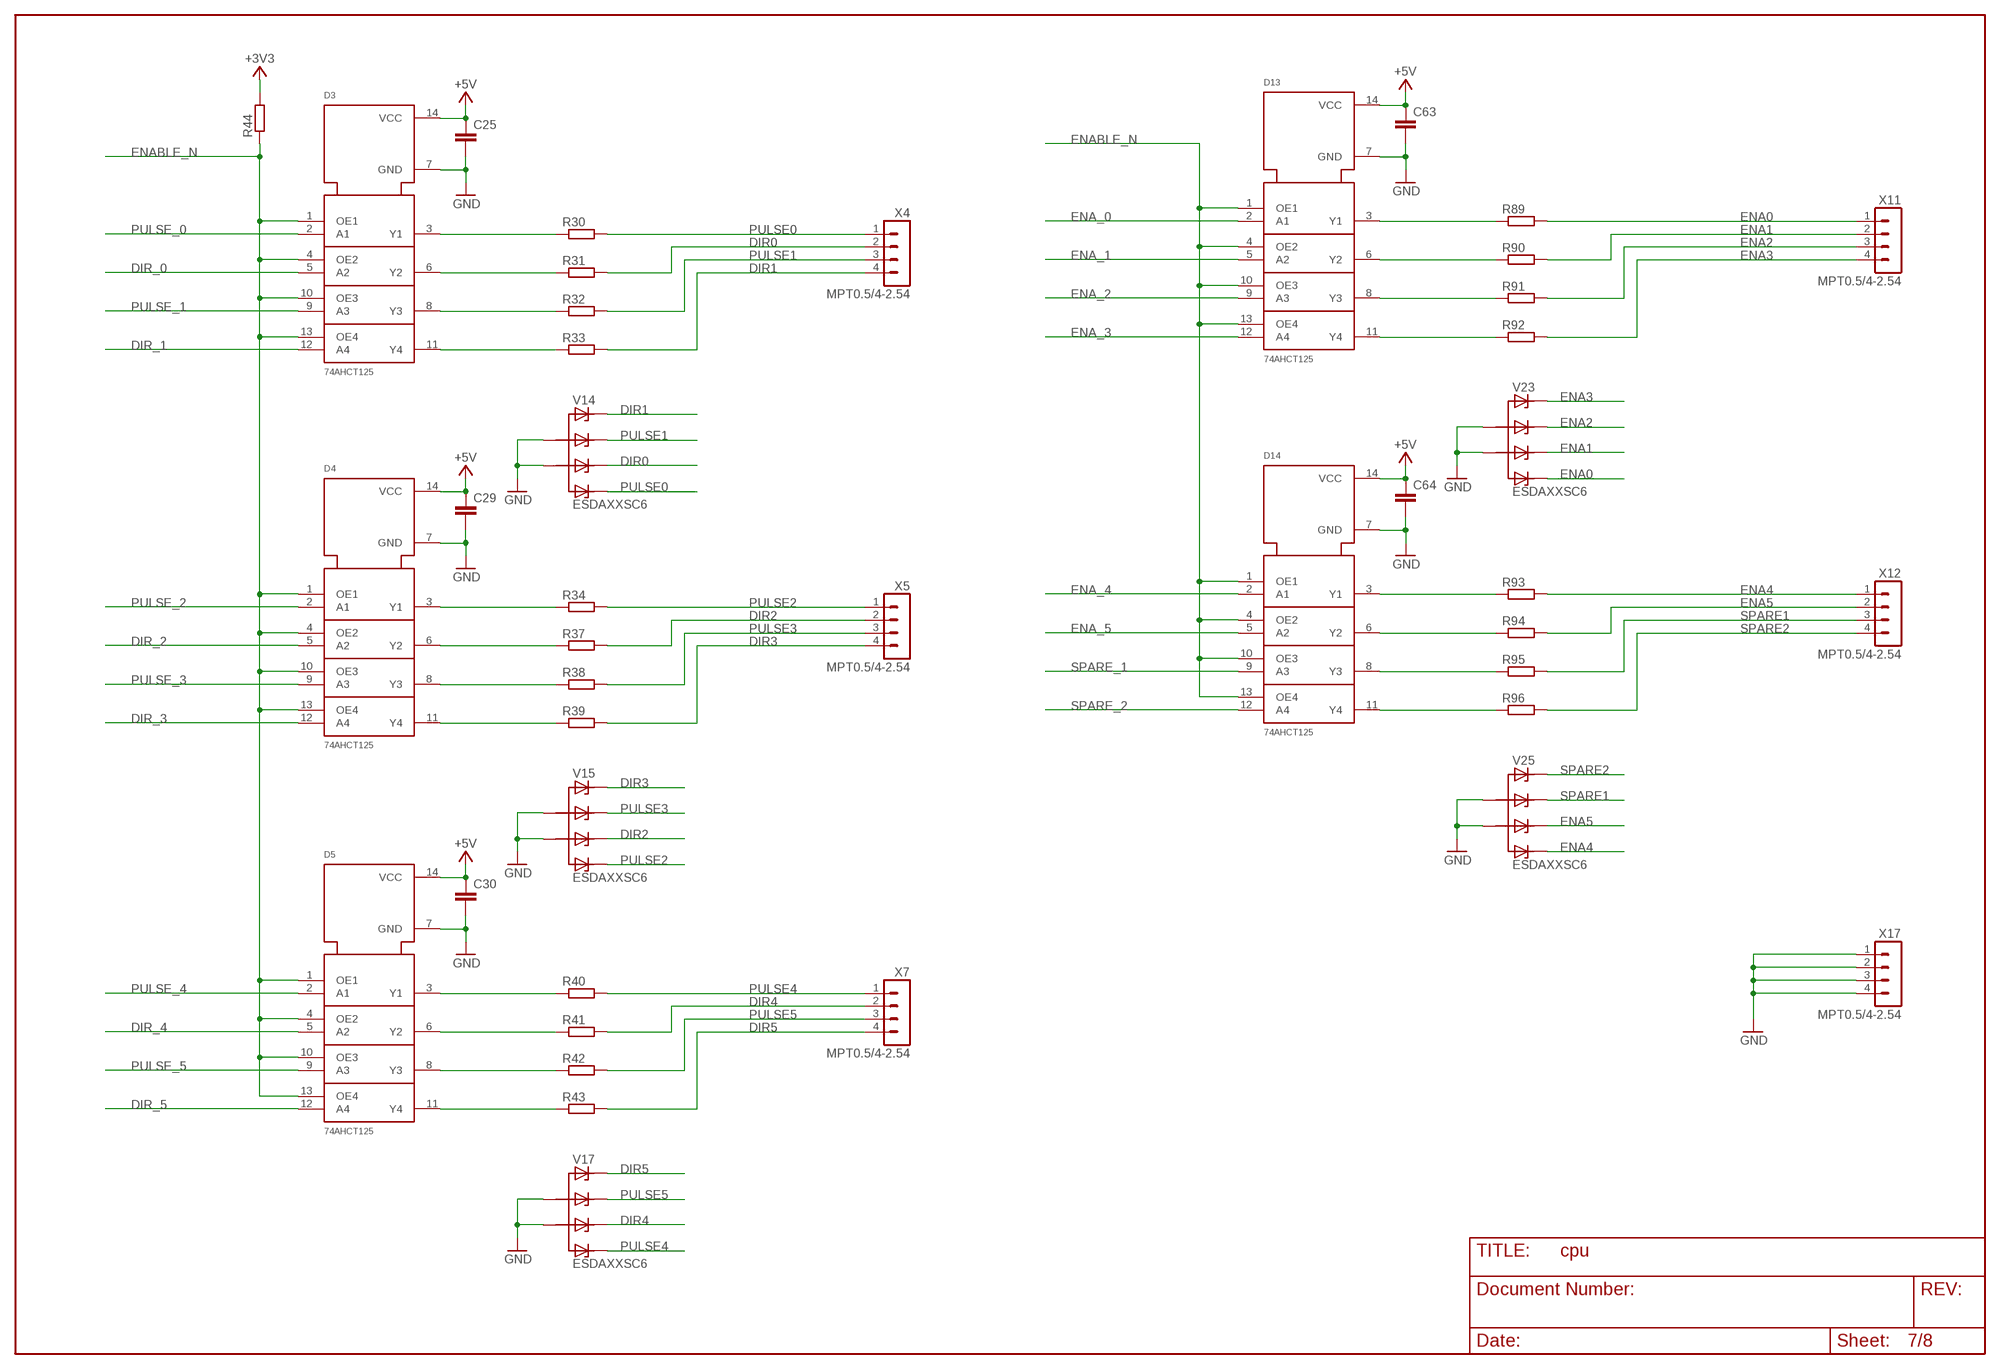
[diagram p6: schematic, sheet 7]

### Parts
C25  CAP0603  [OMAT_IC_2_C0603]
C29  CAP0603  [OMAT_IC_2_C0603]
C30  CAP0603  [OMAT_IC_2_C0603]
C63  CAP0603  [OMAT_IC_2_C0603]
C64  CAP0603  [OMAT_IC_2_C0603]
D3  74AHCT125  [SO14]
D4  74AHCT125  [SO14]
D5  74AHCT125  [SO14]
D13  74AHCT125  [SO14]
D14  74AHCT125  [SO14]
R30  RES0603  [OMAT_IC_2_R0603]
R31  RES0603  [OMAT_IC_2_R0603]
R32  RES0603  [OMAT_IC_2_R0603]
R33  RES0603  [OMAT_IC_2_R0603]
R34  RES0603  [OMAT_IC_2_R0603]
R37  RES0603  [OMAT_IC_2_R0603]
R38  RES0603  [OMAT_IC_2_R0603]
R39  RES0603  [OMAT_IC_2_R0603]
R40  RES0603  [OMAT_IC_2_R0603]
R41  RES0603  [OMAT_IC_2_R0603]
R42  RES0603  [OMAT_IC_2_R0603]
R43  RES0603  [OMAT_IC_2_R0603]
R44  RES0603  [OMAT_IC_2_R0603]
R89  RES0603  [OMAT_IC_2_R0603]
R90  RES0603  [OMAT_IC_2_R0603]
R91  RES0603  [OMAT_IC_2_R0603]
R92  RES0603  [OMAT_IC_2_R0603]
R93  RES0603  [OMAT_IC_2_R0603]
R94  RES0603  [OMAT_IC_2_R0603]
R95  RES0603  [OMAT_IC_2_R0603]
R96  RES0603  [OMAT_IC_2_R0603]
V14  ESDAXXSC6  [OMAT_IC_2_SOT23-6]
V15  ESDAXXSC6  [OMAT_IC_2_SOT23-6]
V17  ESDAXXSC6  [OMAT_IC_2_SOT23-6]
V23  ESDAXXSC6  [OMAT_IC_2_SOT23-6]
V25  ESDAXXSC6  [OMAT_IC_2_SOT23-6]
X4  MPT0.5/4-2.54  [MPT0.5/4-2.54]
X5  MPT0.5/4-2.54  [MPT0.5/4-2.54]
X7  MPT0.5/4-2.54  [MPT0.5/4-2.54]
X11  MPT0.5/4-2.54  [MPT0.5/4-2.54]
X12  MPT0.5/4-2.54  [MPT0.5/4-2.54]
X17  MPT0.5/4-2.54  [MPT0.5/4-2.54]

### Nets
+3V3: R44.2 ; also sheet 1,2,3,4,8
+5V: C25.1 C29.1 C30.1 C63.1 C64.1 D3.14(VCC) D4.14(VCC) D5.14(VCC) D13.14(VCC) D14.14(VCC) ; also sheet 1,4,6
DIR0: R31.2 V14.4(C2) X4.2
DIR1: R33.2 V14.1(C) X4.4
DIR2: R37.2 V15.4(C2) X5.2
DIR3: R39.2 V15.1(C) X5.4
DIR4: R41.2 V17.4(C2) X7.2
DIR5: R43.2 V17.1(C) X7.4
DIR_0: D3.5(A2) ; also sheet 3
DIR_1: D3.12(A4) ; also sheet 3
DIR_2: D4.5(A2) ; also sheet 3
DIR_3: D4.12(A4) ; also sheet 3
DIR_4: D5.5(A2) ; also sheet 3
DIR_5: D5.12(A4) ; also sheet 3
ENA0: R89.2 V23.6(C3) X11.1
ENA1: R90.2 V23.4(C2) X11.2
ENA2: R91.2 V23.3(C1) X11.3
ENA3: R92.2 V23.1(C) X11.4
ENA4: R93.2 V25.6(C3) X12.1
ENA5: R94.2 V25.4(C2) X12.2
ENA_0: D13.2(A1) ; also sheet 3
ENA_1: D13.5(A2) ; also sheet 3
ENA_2: D13.9(A3) ; also sheet 3
ENA_3: D13.12(A4) ; also sheet 3
ENA_4: D14.2(A1) ; also sheet 3
ENA_5: D14.5(A2) ; also sheet 3
ENABLE_N [other]: D3.1(OE1) D3.4(OE2) D3.10(OE3) D3.13(OE4) D4.1(OE1) D4.4(OE2) D4.10(OE3) D4.13(OE4) D5.1(OE1) D5.4(OE2) D5.10(OE3) D5.13(OE4) D13.1(OE1) D13.4(OE2) D13.10(OE3) D13.13(OE4) D14.1(OE1) D14.4(OE2) D14.10(OE3) D14.13(OE4) R44.1 ; also sheet 3
GND [other]: C25.2 C29.2 C30.2 C63.2 C64.2 D3.7(GND) D4.7(GND) D5.7(GND) D13.7(GND) D14.7(GND) V14.2(A) V14.5(A1) V15.2(A) V15.5(A1) V17.2(A) V17.5(A1) V23.2(A) V23.5(A1) V25.2(A) V25.5(A1) X17.1 X17.2 X17.3 X17.4 ; also sheet 1,2,3,4,5,6,8
N$7: D3.3(Y1) R30.1
N$9: D3.6(Y2) R31.1
N$12: D3.8(Y3) R32.1
N$14: D3.11(Y4) R33.1
N$30: D4.3(Y1) R34.1
N$31: D4.6(Y2) R37.1
N$32: D4.8(Y3) R38.1
N$33: D4.11(Y4) R39.1
N$34: D5.3(Y1) R40.1
N$35: D5.6(Y2) R41.1
N$36: D5.8(Y3) R42.1
N$37: D5.11(Y4) R43.1
N$44: D13.3(Y1) R89.1
N$46: D13.6(Y2) R90.1
N$48: D13.8(Y3) R91.1
N$50: D13.11(Y4) R92.1
N$52: D14.3(Y1) R93.1
N$54: D14.6(Y2) R94.1
N$56: D14.8(Y3) R95.1
N$58: D14.11(Y4) R96.1
PULSE0: R30.2 V14.6(C3) X4.1
PULSE1: R32.2 V14.3(C1) X4.3
PULSE2: R34.2 V15.6(C3) X5.1
PULSE3: R38.2 V15.3(C1) X5.3
PULSE4: R40.2 V17.6(C3) X7.1
PULSE5: R42.2 V17.3(C1) X7.3
PULSE_0: D3.2(A1) ; also sheet 3
PULSE_1: D3.9(A3)
PULSE_2: D4.2(A1) ; also sheet 3
PULSE_3: D4.9(A3) ; also sheet 3
PULSE_4: D5.2(A1) ; also sheet 3
PULSE_5: D5.9(A3) ; also sheet 3
SPARE1: R95.2 V25.3(C1) X12.3
SPARE2: R96.2 V25.1(C) X12.4
SPARE_1: D14.9(A3) ; also sheet 3
SPARE_2: D14.12(A4) ; also sheet 3

## Sheet 8 of 8
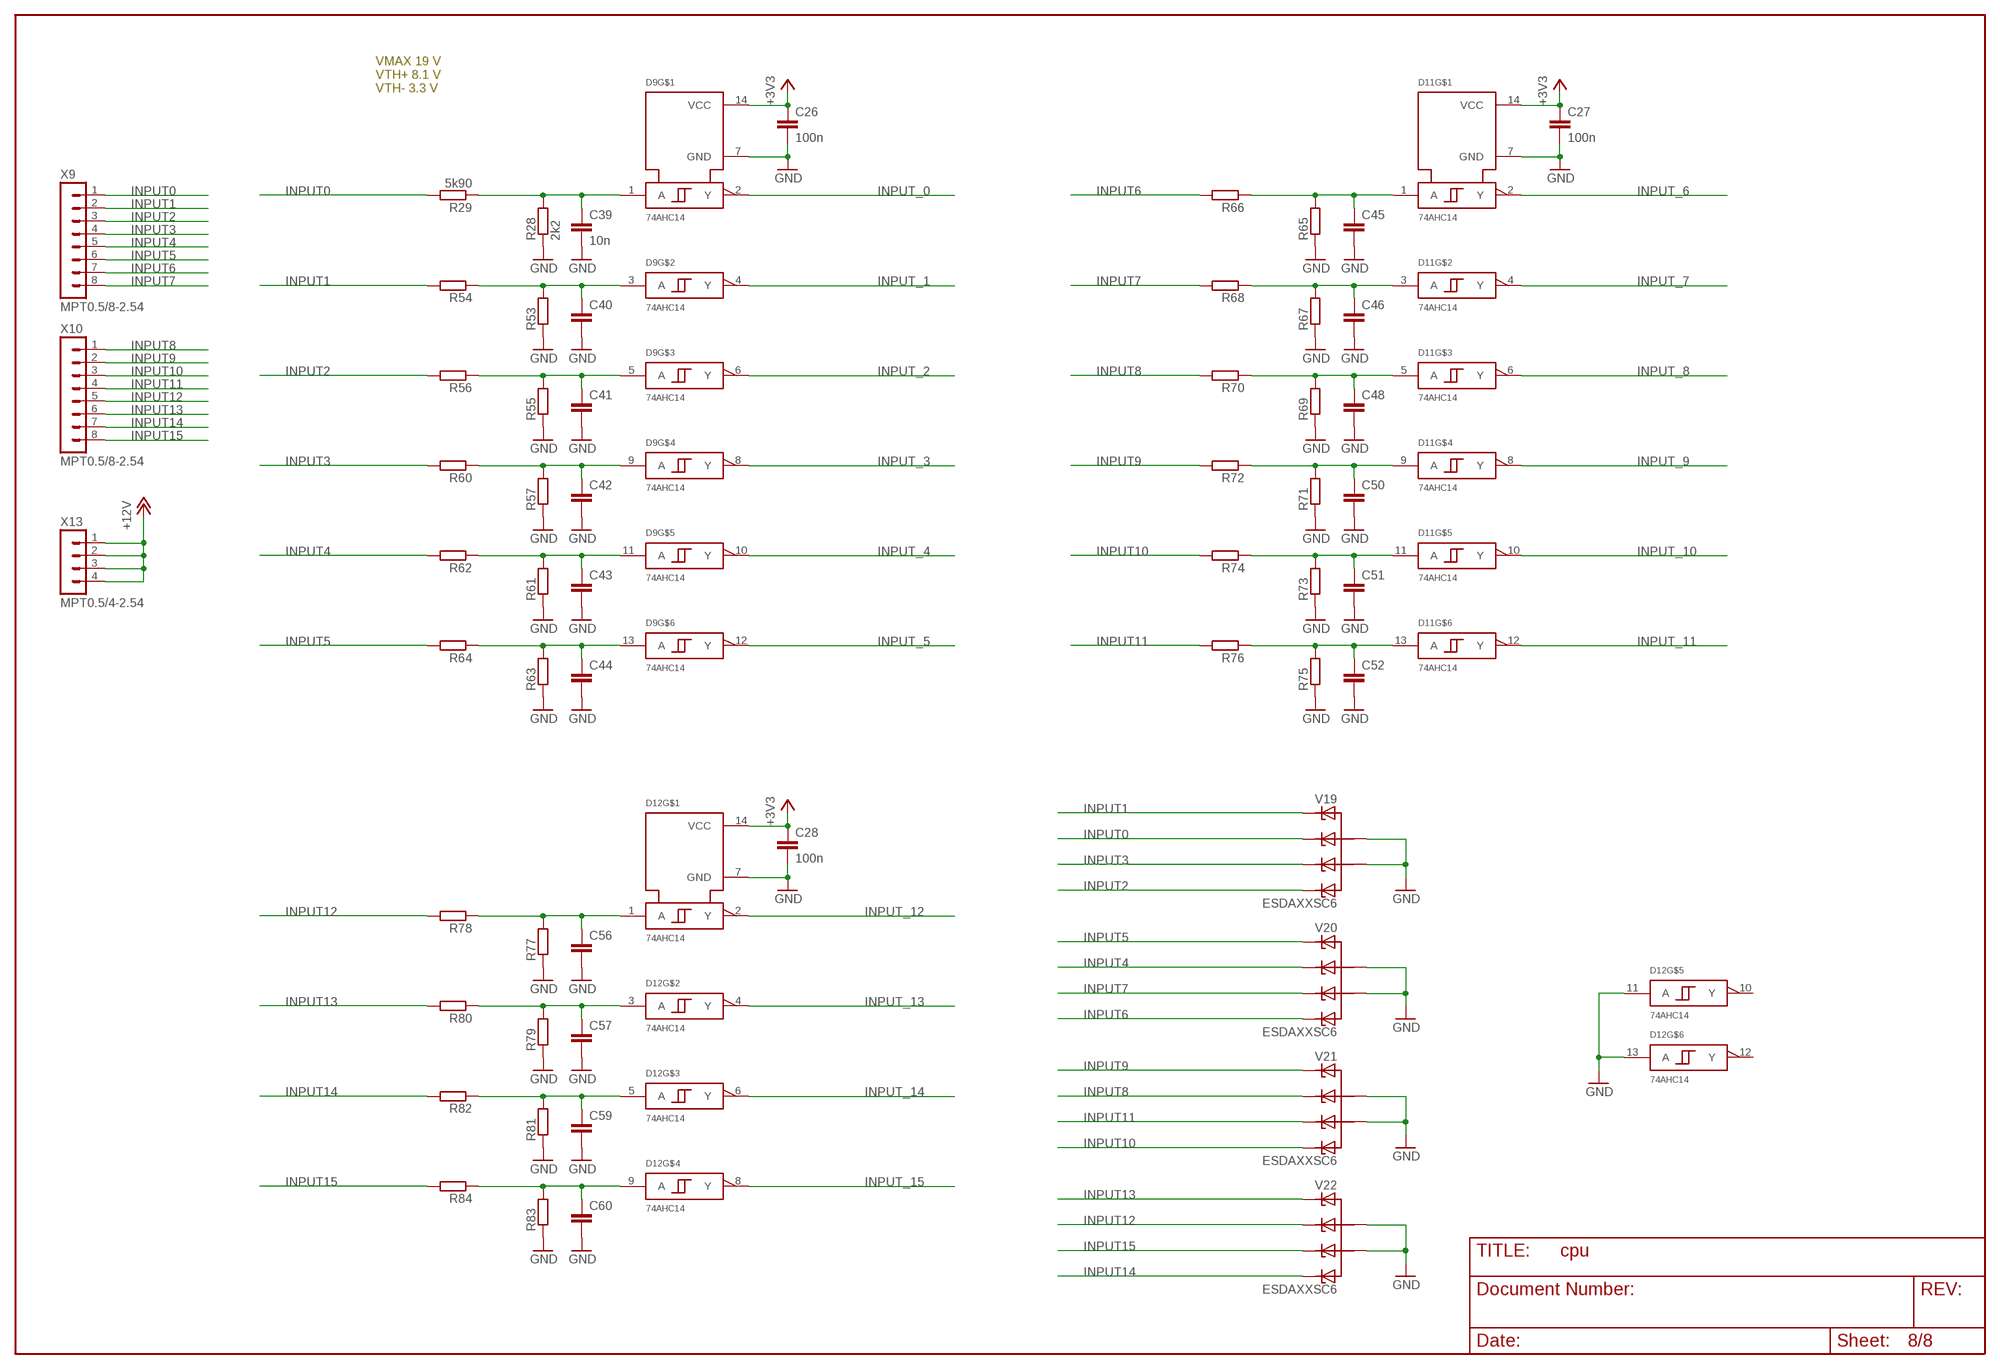
[diagram p7: schematic, sheet 8]

### Parts
C26  100n  CAP0603  [C0603]
C27  100n  CAP0603  [C0603]
C28  100n  CAP0603  [C0603]
C39  10n  CAP0603  [OMAT_IC_2_C0603]
C40  CAP0603  [OMAT_IC_2_C0603]
C41  CAP0603  [OMAT_IC_2_C0603]
C42  CAP0603  [OMAT_IC_2_C0603]
C43  CAP0603  [OMAT_IC_2_C0603]
C44  CAP0603  [OMAT_IC_2_C0603]
C45  CAP0603  [OMAT_IC_2_C0603]
C46  CAP0603  [OMAT_IC_2_C0603]
C48  CAP0603  [OMAT_IC_2_C0603]
C50  CAP0603  [OMAT_IC_2_C0603]
C51  CAP0603  [OMAT_IC_2_C0603]
C52  CAP0603  [OMAT_IC_2_C0603]
C56  CAP0603  [OMAT_IC_2_C0603]
C57  CAP0603  [OMAT_IC_2_C0603]
C59  CAP0603  [OMAT_IC_2_C0603]
C60  CAP0603  [OMAT_IC_2_C0603]
D9  74AHC14  [SO14]
D11  74AHC14  [SO14]
D12  74AHC14  [SO14]
R28  2k2  RES0603  [OMAT_IC_2_R0603]
R29  5k90  RES0603  [OMAT_IC_2_R0603]
R53  RES0603  [OMAT_IC_2_R0603]
R54  RES0603  [OMAT_IC_2_R0603]
R55  RES0603  [OMAT_IC_2_R0603]
R56  RES0603  [OMAT_IC_2_R0603]
R57  RES0603  [OMAT_IC_2_R0603]
R60  RES0603  [OMAT_IC_2_R0603]
R61  RES0603  [OMAT_IC_2_R0603]
R62  RES0603  [OMAT_IC_2_R0603]
R63  RES0603  [OMAT_IC_2_R0603]
R64  RES0603  [OMAT_IC_2_R0603]
R65  RES0603  [OMAT_IC_2_R0603]
R66  RES0603  [OMAT_IC_2_R0603]
R67  RES0603  [OMAT_IC_2_R0603]
R68  RES0603  [OMAT_IC_2_R0603]
R69  RES0603  [OMAT_IC_2_R0603]
R70  RES0603  [OMAT_IC_2_R0603]
R71  RES0603  [OMAT_IC_2_R0603]
R72  RES0603  [OMAT_IC_2_R0603]
R73  RES0603  [OMAT_IC_2_R0603]
R74  RES0603  [OMAT_IC_2_R0603]
R75  RES0603  [OMAT_IC_2_R0603]
R76  RES0603  [OMAT_IC_2_R0603]
R77  RES0603  [OMAT_IC_2_R0603]
R78  RES0603  [OMAT_IC_2_R0603]
R79  RES0603  [OMAT_IC_2_R0603]
R80  RES0603  [OMAT_IC_2_R0603]
R81  RES0603  [OMAT_IC_2_R0603]
R82  RES0603  [OMAT_IC_2_R0603]
R83  RES0603  [OMAT_IC_2_R0603]
R84  RES0603  [OMAT_IC_2_R0603]
V19  ESDAXXSC6  [OMAT_IC_2_SOT23-6]
V20  ESDAXXSC6  [OMAT_IC_2_SOT23-6]
V21  ESDAXXSC6  [OMAT_IC_2_SOT23-6]
V22  ESDAXXSC6  [OMAT_IC_2_SOT23-6]
X9  MPT0.5/8-2.54  [OMAT_IC_2_MPT0.5/8-2.54]
X10  MPT0.5/8-2.54  [OMAT_IC_2_MPT0.5/8-2.54]
X13  MPT0.5/4-2.54  [MPT0.5/4-2.54]

### Nets
+3V3: C26.1 C27.1 C28.1 D9.14(VCC) D11.14(VCC) D12.14(VCC) ; also sheet 1,2,3,4,7
+12V: X13.1 X13.2 X13.3 X13.4 ; also sheet 1,2,5
GND [other]: C26.2 C27.2 C28.2 C39.2 C40.2 C41.2 C42.2 C43.2 C44.2 C45.2 C46.2 C48.2 C50.2 C51.2 C52.2 C56.2 C57.2 C59.2 C60.2 D9.7(GND) D11.7(GND) D12.7(GND) D12.11(A) D12.13(A) R28.1 R53.1 R55.1 R57.1 R61.1 R63.1 R65.1 R67.1 R69.1 R71.1 R73.1 R75.1 R77.1 R79.1 R81.1 R83.1 V19.2(A) V19.5(A1) V20.2(A) V20.5(A1) V21.2(A) V21.5(A1) V22.2(A) V22.5(A1) ; also sheet 1,2,3,4,5,6,7
INPUT0: R29.2 V19.3(C1) X9.1
INPUT1: R54.2 V19.1(C) X9.2
INPUT2: R56.2 V19.6(C3) X9.3
INPUT3: R60.2 V19.4(C2) X9.4
INPUT4: R62.2 V20.3(C1) X9.5
INPUT5: R64.2 V20.1(C) X9.6
INPUT6: R66.2 V20.6(C3) X9.7
INPUT7: R68.2 V20.4(C2) X9.8
INPUT8: R70.2 V21.3(C1) X10.1
INPUT9: R72.2 V21.1(C) X10.2
INPUT10: R74.2 V21.6(C3) X10.3
INPUT11: R76.2 V21.4(C2) X10.4
INPUT12: R78.2 V22.3(C1) X10.5
INPUT13: R80.2 V22.1(C) X10.6
INPUT14: R82.2 V22.6(C3) X10.7
INPUT15: R84.2 V22.4(C2) X10.8
INPUT_0: D9.2(Y) ; also sheet 3
INPUT_1: D9.4(Y) ; also sheet 3
INPUT_2: D9.6(Y) ; also sheet 3
INPUT_3: D9.8(Y) ; also sheet 3
INPUT_4: D9.10(Y) ; also sheet 3
INPUT_5: D9.12(Y) ; also sheet 3
INPUT_6: D11.2(Y) ; also sheet 2
INPUT_7: D11.4(Y) ; also sheet 2
INPUT_8: D11.6(Y) ; also sheet 3
INPUT_9: D11.8(Y) ; also sheet 3
INPUT_10: D11.10(Y) ; also sheet 3
INPUT_11: D11.12(Y) ; also sheet 3
INPUT_12: D12.2(Y) ; also sheet 3
INPUT_13: D12.4(Y) ; also sheet 3
INPUT_14: D12.6(Y) ; also sheet 3
INPUT_15: D12.8(Y) ; also sheet 3
N$38: C39.1 D9.1(A) R28.2 R29.1
N$41: C40.1 D9.3(A) R53.2 R54.1
N$43: C41.1 D9.5(A) R55.2 R56.1
N$45: C42.1 D9.9(A) R57.2 R60.1
N$47: C43.1 D9.11(A) R61.2 R62.1
N$49: C44.1 D9.13(A) R63.2 R64.1
N$51: C45.1 D11.1(A) R65.2 R66.1
N$53: C46.1 D11.3(A) R67.2 R68.1
N$55: C48.1 D11.5(A) R69.2 R70.1
N$57: C50.1 D11.9(A) R71.2 R72.1
N$59: C51.1 D11.11(A) R73.2 R74.1
N$61: C52.1 D11.13(A) R75.2 R76.1
N$63: C56.1 D12.1(A) R77.2 R78.1
N$65: C57.1 D12.3(A) R79.2 R80.1
N$67: C59.1 D12.5(A) R81.2 R82.1
N$69: C60.1 D12.9(A) R83.2 R84.1
Unconnected: D12.10(Y) D12.12(Y)

### Notes on the sheet
- VMAX 19 V
  VTH+ 8.1 V
  VTH- 3.3 V

## Library data of the parts
C1 C31 C35 = EKE:CPOL-EU: POLARIZED CAPACITOR, European symbol
C2-C4 C8-C24 C26-C28 C32-C34 C36-C38 C47 C49 C53-C55 C58 C61 C62 = omat_ic_2:CAP
C5-C7 C25 C29 C30 C39-C46 C48 C50-C52 C56 C57 C59 C60 C63-C69 = cpu:CAP
D1 = omat_ic_2:STM32F407ZG
D2-D5 D13 D14 = cpu:74AHCT125
D6 = omat_ic_2:LM75BD
D7 = omat_ic_2:IIS328DQTR
D8 = omat_ic_2:MAX3088_SA
D9 D11 D12 = cpu:74AHC14
D10 = omat_ic_2:RT9818C-29GV
D15 = cpu:PCA9517
F1 = cpu:MINIBLADE-FUSEHOLDER
G1 = omat_ic_2:XTAL_3225_SMD: CRYSTAL CLOCK OSCILLATORS 5.0 Vdc or 3.3 Vdc - LOW PROFILE ULTRA MINIATURE CERAMIC SURFACE MOUNT Source: http://www.abracon.com/Oscillators/asf1-L-L1.pdf
H1-H3 = omat_ic_2:LED: LED OSRAM: - CHIPLED LG R971, LG N971, LY N971, LG Q971, LY Q971, LO R971, LY R971 LH N974, LH R974 LS Q976, LO Q976, LY Q976 LO Q996 - Hyper CHIPLED LW Q18S LB Q993, LB Q99A, LB R99A - SideLED LS A670, LO A670, LY A670, LG A670, LP A670 LB A673, LV A673, LT A673, LW A673 LH A674 LY A675 LS A676, LA A676, LO A676, LY A676, LW A676 LS A679, LY A679, LG A679 - Hyper Micro SIDELED® LS Y876, LA Y876, LO Y876, LY Y876 LT Y87S - SmartLED LW L88C, LW L88S LB L89C, LB L89S, LG L890 LS L89K, LO L89K, LY L89K LS L896, LA L896, LO L896, LY L896 - TOPLED LS T670, LO T670, LY T670, LG T670, LP T670 LSG T670, LSP T670, LSY T670, LOP T670, LYG T670 LG T671, LOG T671, LSG T671 LB T673, LV T673, LT T673, LW T673 LH T674 LS T676, LA T676, LO T676, LY T676, LB T676, LH T676, LSB T676, LW T676 LB T67C, LV T67C, LT T67C, LS T67K, LO T67K, LY T67K, LW E67C LS E67B, LA E67B, LO E67B, LY E67B, LB E67C, LV E67C, LT E67C LW T67C LS T679, LY T679, LG T679 LS T770, LO T770, LY T770, LG T770, LP T770 LB T773, LV T773, LT T773, LW T773 LH T774 LS E675, LA E675, LY E675, LS T675 LS T776, LA T776, LO T776, LY T776, LB T776 LHGB T686 LT T68C, LB T68C - Hyper Mini TOPLED® LB M676 - Mini TOPLED Santana® LG M470 LS M47K, LO M47K, LY M47K Source: http://www.osram.convergy.de LUXEON: - LUMILED® LXK2-PW12-R00, LXK2-PW12-S00, LXK2-PW14-U00, LXK2-PW14-V00 LXK2-PM12-R00, LXK2-PM12-S00, LXK2-PM14-U00 LXK2-PE12-Q00, LXK2-PE12-R00, LXK2-PE12-S00, LXK2-PE14-T00, LXK2-PE14-U00 LXK2-PB12-K00, LXK2-PB12-L00, LXK2-PB12-M00, LXK2-PB14-N00, LXK2-PB14-P00, LXK2-PB14-Q00 LXK2-PR12-L00, LXK2-PR12-M00, LXK2-PR14-Q00, LXK2-PR14-R00 LXK2-PD12-Q00, LXK2-PD12-R00, LXK2-PD12-S00 LXK2-PH12-R00, LXK2-PH12-S00 LXK2-PL12-P00, LXK2-PL12-Q00, LXK2-PL12-R00 Source: www.luxeon.com KINGBRIGHT: KA-3528ASYC Source: www.kingbright.com
L1 L4 L5 L8 L9 = cpu:IND
L2 L3 L7 = omat_ic_2:IND
L6 = omat_ic_2:VLP8040
N1 N2 = omat_ic_2:TPS5430
N3 = omat_ic_2:MCP1501/SN
Q1-Q4 = cpu:PTC
R1 R2 R8-R20 R24 R25 R36 R49-R52 R58 R59 R85 R99 R100 = omat_ic_2:RES
R3-R7 R21 = aux-io:PASSIIVIT_RES
R22 R23 R26-R35 R37-R48 R53-R57 R60-R84 R86-R96 = cpu:RES
U$1 = telakone-aux-gps:DAFUG
V1 = cpu:2N3904
V2 V4 = omat_ic_2:AO4803A
V3 V5 V7 V9 = omat_ic_2:2N7002K
V6 V14 V15 V17 V19-V23 V25 V27 = cpu:ESDAXXSC6
V8 V10-V12 V18 = omat_ic_2:SK34A
V13 = cpu:SBRD10200
V16 = omat_ic_2:SMAJXXA
V24 = omat_ic_2:ESDAXXSC6
V26 = cpu:SRV05-4
V36 = omat_ic_2:SM712
X1 = aux-io:LIITTIMET_X3815-10
X2 X9 X10 = cpu:MPT0.5/8-2.54
X3 = omat_ic_2:MPT0.5/8-2.54
X4 X5 X7 X11-X17 = cpu:MPT0.5/4-2.54
X6 = omat_ic_2:TE_RUUVILIITIN2
X8 = cpu:PS-JOYSTICK
X18 = cpu:629105136821: WR-COM SMT Horizontal 5 Contacts Micro USB Type B,5 pins
Y1-Y4 = EKE:PTH

## Net classes
2 other: width 0.3 mm, drill 0.3 mm, clearance 1 mm to class 1